# EAGLE schematic baseboard (EAGLE 7.7.0)

## Sheet 1 of 2: POW-System Supply Chain
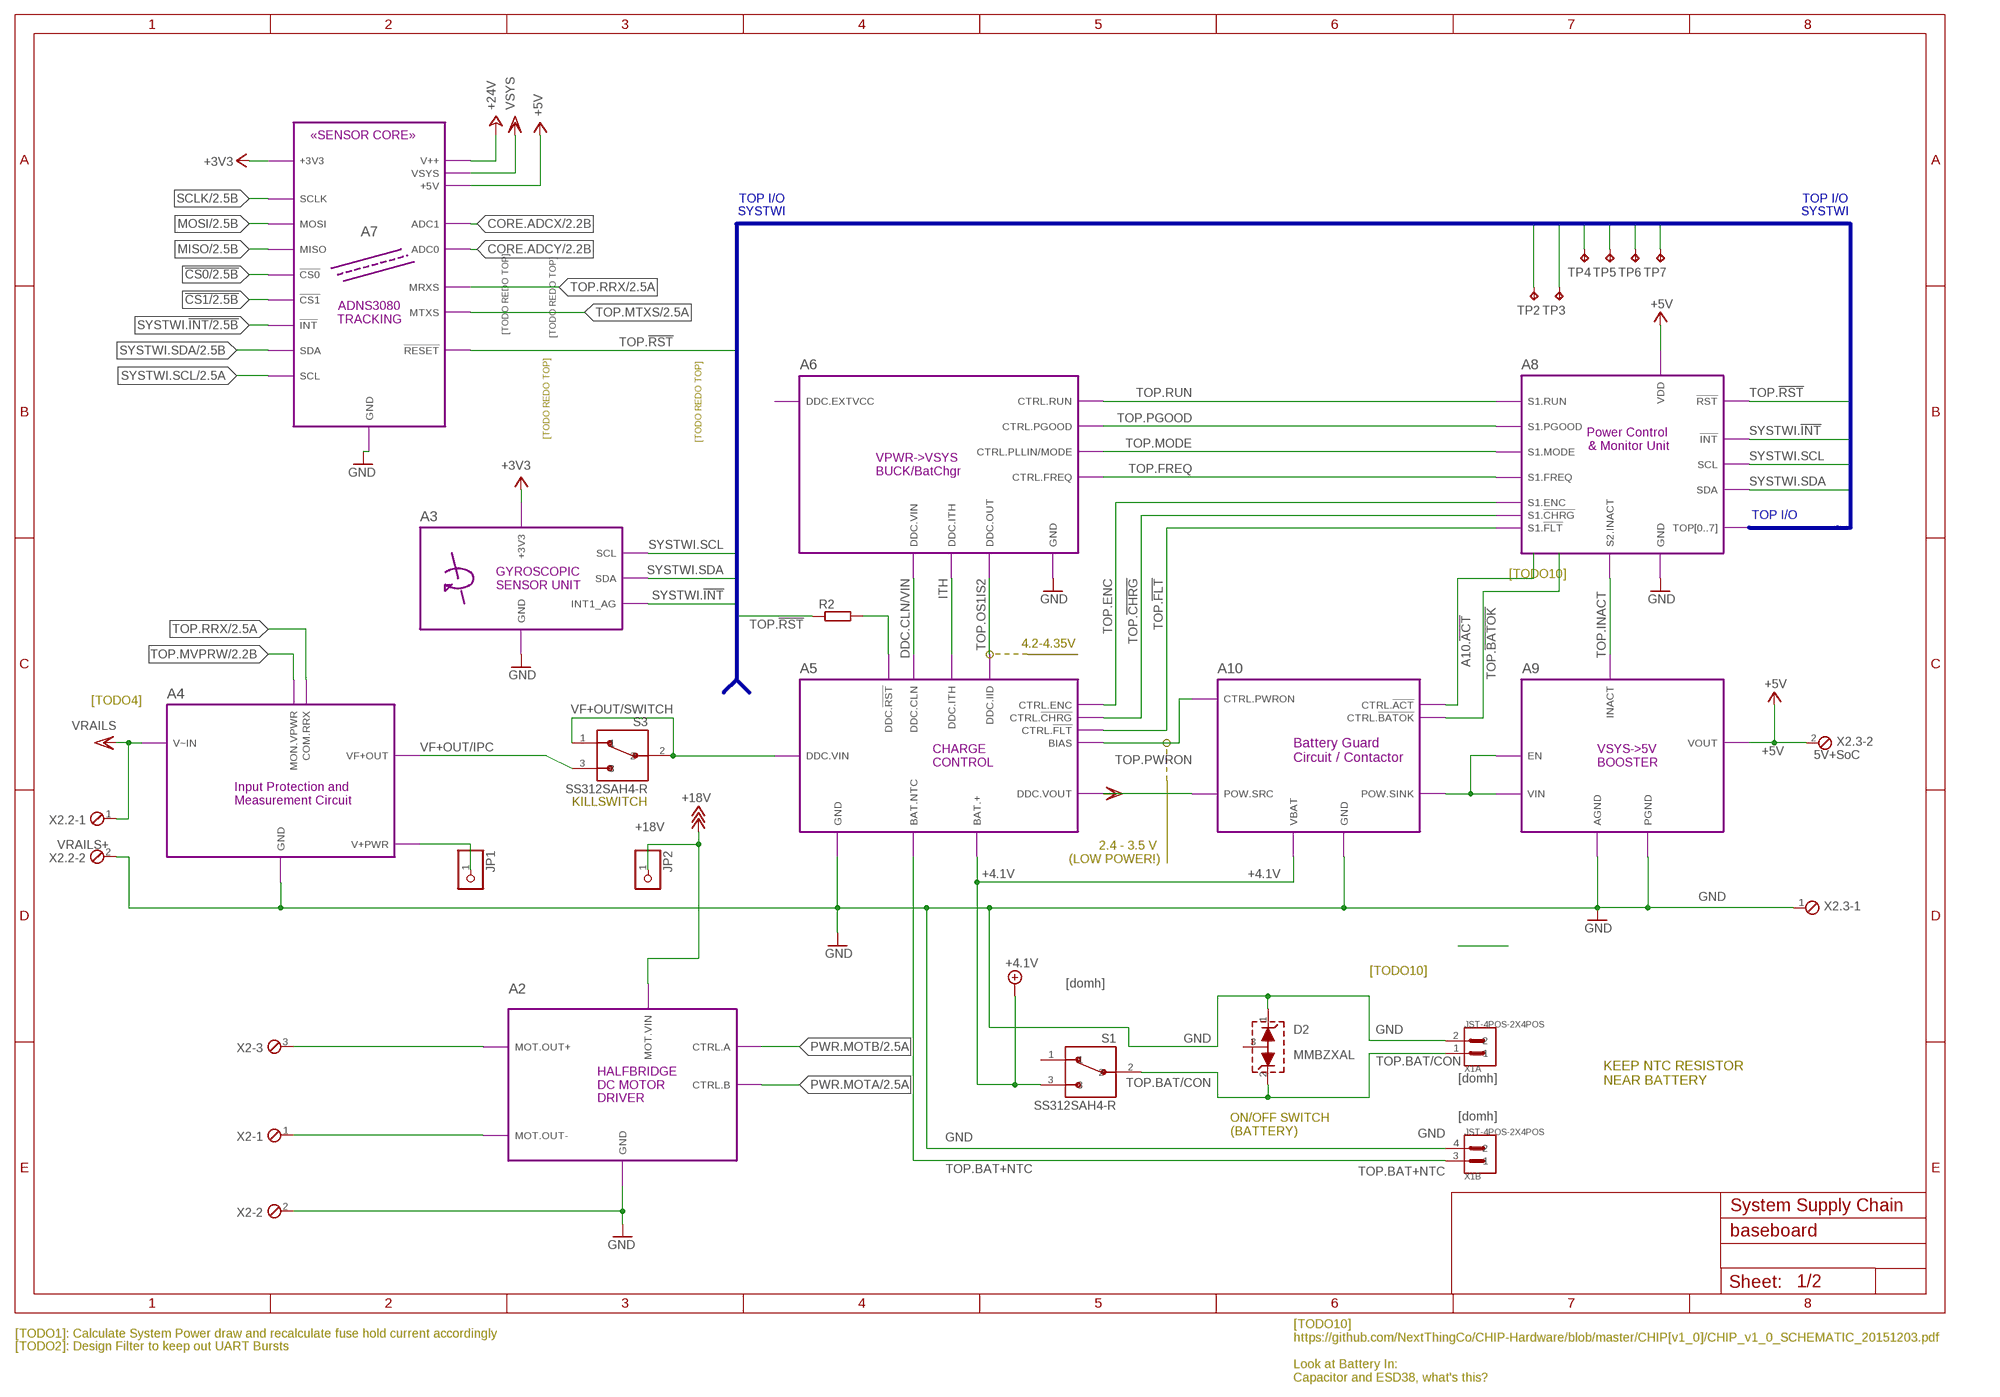
[diagram p0: schematic, sheet 1]

### Parts
D2  MMBZXAL  [TO236]
JP1  PINHD-1X1  [1X01]
JP2  PINHD-1X1  [1X01]
R2  R-EU_R0201  [R0201]
S1  SS312SAH4-R  [SW_SS312SAH4-R]
S3  SS312SAH4-R  [SW_SS312SAH4-R]
TP2  TPTP07R  [TP07R]
TP3  TPTP07R  [TP07R]
TP4  TPTP07R  [TP07R]
TP5  TPTP07R  [TP07R]
TP6  TPTP07R  [TP07R]
TP7  TPTP07R  [TP07R]
X1  JST-4POS-2X4POS  [JST-PHR-4]
X2  MPT3  [3POL254]
X2.2  VRAILS+  MPT2  [2POL254]
X2.3  5V+SoC  MPT2  [2POL254]

### Module instances
A5 = POW-4000
A6 = POW-3891
A2 = POW-8871
A9 = POW-DDC3350
A8 = POW-CTRLMON
A7 = X1-TRACKBOARD3080
A4 = POW-IPMC
A3 = SEN-GYRO1
A10 = POW-1540

### Nets
!CS0: port A7.!CS0 ; also sheet 2
!CS1: port A7.!CS1 ; also sheet 2
!RST: R2.2 ; port A5.DDC.!RST
+3V3: port A7.+3V3 A3.+3V3 ; also sheet 2
+4.1V: S1.3 ; port A5.BAT.+ A10.VBAT ; also sheet 2
+5V: X2.3.2 ; port A9.VOUT A7.+5V A8.VDD ; also sheet 2
+18V: JP2.1 ; port A2.MOT.VIN ; also sheet 2
+24V: JP1.1 ; port A4.V+PWR A7.V++ ; also sheet 2
A10.!ACT: port A10.CTRL.!ACT
CORE.ADCX: port A7.ADC1 ; also sheet 2
CORE.ADCY: port A7.ADC0 ; also sheet 2
DDC.CLN/VIN: port A6.DDC.VIN A5.DDC.CLN
GND: D2.1(A) X1.2 X1.4 X2.2 X2.2.2 X2.3.1 ; port A6.GND A5.GND A9.AGND A9.PGND A4.GND A10.GND A2.GND A7.GND A3.GND A8.GND ; also sheet 2
ITH: port A6.DDC.ITH A5.DDC.ITH
MISO: port A7.MISO ; also sheet 2
MOSI: port A7.MOSI ; also sheet 2
PWR.MOTA: port A2.CTRL.B ; also sheet 2
PWR.MOTB: port A2.CTRL.A ; also sheet 2
SCLK: port A7.SCLK ; also sheet 2
SYSTWI.!INT: port A3.INT1_AG A8.!INT A7.!INT ; also sheet 2
SYSTWI.SCL: port A3.SCL A8.SCL A7.SCL ; also sheet 2
SYSTWI.SDA: port A3.SDA A8.SDA A7.SDA ; also sheet 2
TOP1: TP2.TP
TOP2: TP3.TP
TOP3: TP4.TP
TOP4: TP5.TP
TOP5: TP6.TP
TOP6: TP7.TP
TOP.!BATOK: port A10.CTRL.!BATOK
TOP.!CHRG: port A5.CTRL.!CHRG A8.S1.!CHRG
TOP.!FLT: port A5.CTRL.!FLT A8.S1.!FLT
TOP.!RST: R2.1 ; port A8.!RST A7.!RESET ; also sheet 2
TOP.BAT+NTC: X1.3 ; port A5.BAT.NTC
TOP.BAT/CON: D2.2(B) S1.2 X1.1
TOP.ENC: port A5.CTRL.ENC A8.S1.ENC
TOP.FREQ: port A8.S1.FREQ A6.CTRL.FREQ
TOP.INACT: port A8.S2.INACT A9.INACT
TOP.MODE: port A8.S1.MODE A6.CTRL.PLLIN/MODE
TOP.MOT-: X2.1 ; port A2.MOT.OUT-
TOP.MTXS: port A7.MTXS ; also sheet 2
TOP.MVPRW: port A4.MON.VPWR ; also sheet 2
TOP.OS1IS2: port A6.DDC.OUT A5.DDC.IID
TOP.PGOOD: port A8.S1.PGOOD A6.CTRL.PGOOD
TOP.PWRON: port A5.BIAS A10.CTRL.PWRON
TOP.RRX: port A4.COM.RRX A7.MRXS ; also sheet 2
TOP.RUN: port A6.CTRL.RUN A8.S1.RUN
TOP.VSYS/GUARD: port A9.VIN A10.POW.SINK A9.EN
VCC/2: X2.2.1 ; port A4.V~IN ; supply symbol labelled VRAILS
VDD: port A5.DDC.VOUT A10.POW.SRC A7.VSYS ; supply symbol labelled NOT VSYS ANYMORE, VSYS ; also sheet 2
VF+OUT/IPC: S3.3 ; port A4.VF+OUT
VF+OUT/SWITCH: S3.1 S3.2 ; port A5.DDC.VIN
✳TOP.MOT+: X2.3 ; port A2.MOT.OUT+
Unconnected: D2.3(COM) S1.1

### Buses
TOP[0..7],SYSTWI.SCL,SYSTWI.SDA,SYSTWI.!INT,TOP.!RST
TOP[0..7]

### Notes on the sheet
- «SENSOR CORE»
- TOP I/O | TOP I/O
- SYSTWI | SYSTWI
- ADNS3080
  TRACKING
- [TODO REDO TOP]
- [TODO REDO TOP]
- ⨯
- [TODO REDO TOP]
- Power Control 
  & Monitor Unit
- [TODO REDO TOP]
- ↯
- VPWR->VSYS
  BUCK/BatChgr
- ⎚
- TOP I/O
- GYROSCOPIC
  SENSOR UNIT
- [TODO10]
- 4.2-4.35V
- [TODO4]
- ⎚ | ⎚ | ↯
- CHARGE
  CONTROL
- VSYS->5V
  BOOSTER
- Battery Guard 
  Circuit / Contactor
- ↯
- ↯
- Input Protection and 
  Measurement Circuit
- KILLSWITCH
- 2.4 - 3.5 V 
  (LOW POWER!)
- [TODO10]
- [domh]
- [domh]
- ↯
- HALFBRIDGE
  DC MOTOR
  DRIVER
- KEEP NTC RESISTOR
  NEAR BATTERY
- [domh]
- ON/OFF SWITCH
  (BATTERY)
- System Supply Chain
- [TODO1]: Calculate System Power draw and recalculate fuse hold current accordingly
- [TODO2]: Design Filter to keep out UART Bursts
- [TODO10]
  https://github.com/NextThingCo/CHIP-Hardware/blob/master/CHIP[v1_0]/CHIP_v1_0_SCHEMATIC_20151203.pdf
  
  Look at Battery In:
  Capacitor and ESD38, what's this?

## Sheet 2 of 2: X - Connectors Inputs, Outputs and Power
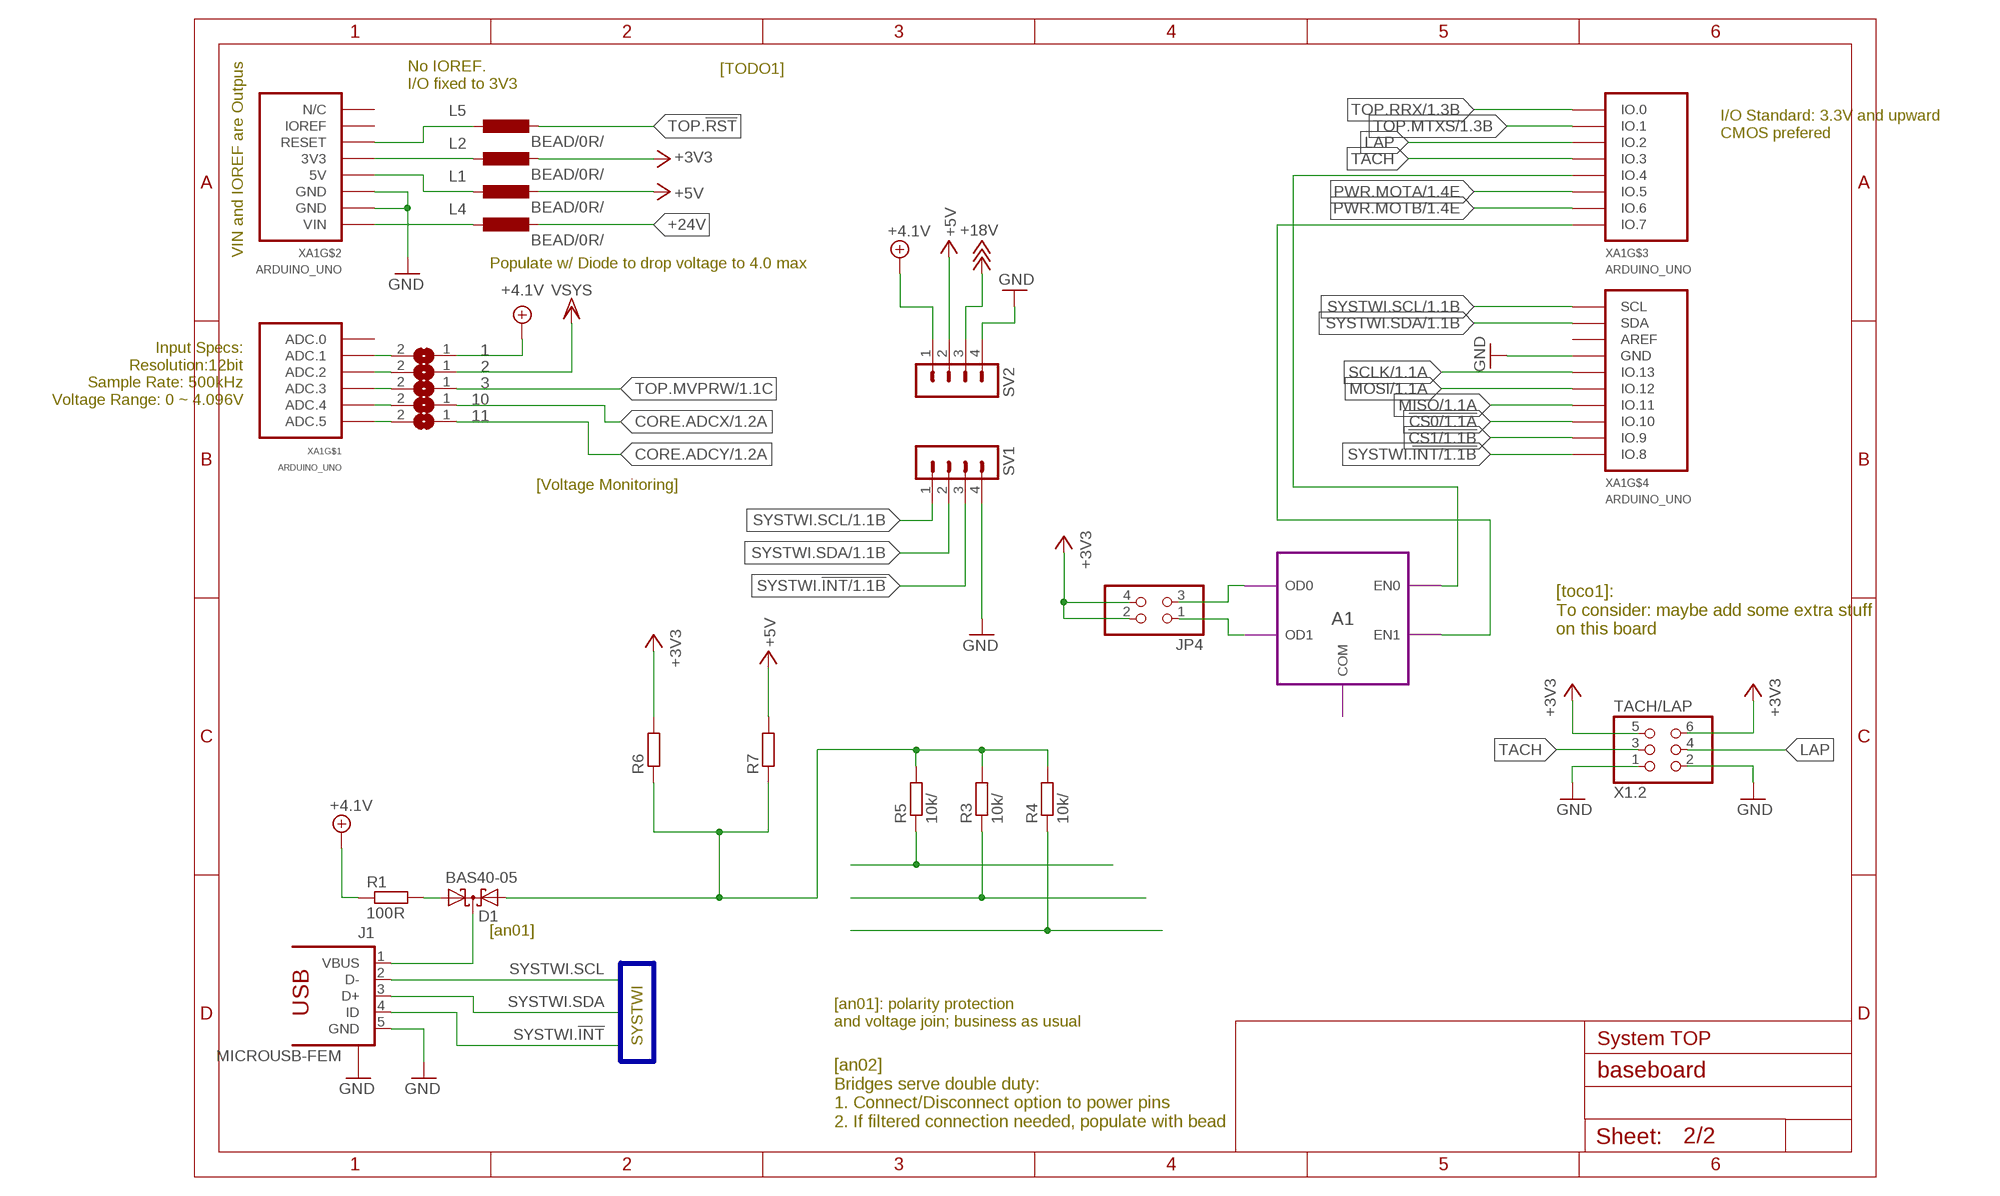
[diagram p1: schematic, sheet 2]

### Parts
D1  BAS40-05  [SOT23]
J1  MICROUSB-FEM  [10118192-0001LF]
JP4  PINHD-2X2  [2X02]
L1  BEAD/0R/⎵  L-EUL2012C  [L2012C]
L2  BEAD/0R/⎵  L-EUL2012C  [L2012C]
L4  BEAD/0R/⎵  L-EUL2012C  [L2012C]
L5  BEAD/0R/⎵  L-EUL2012C  [L2012C]
R1  100R  R-EU_R0402  [R0402]
R3  10k/⎒  R-EU_R0402  [R0402]
R4  10k/⎒  R-EU_R0402  [R0402]
R5  10k/⎒  R-EU_R0402  [R0402]
R6  R-EU_R0201  [R0201]
R7  R-EU_R0201  [R0201]
SV1  MA04-1  [MA04-1]
SV2  MA04-1  [MA04-1]
X1.2  TACH/LAP  PINHD-2X3  [2X03]
XA1  ARDUINO_UNO  [AU_PINS]
☈1  SJ  [SJ]
☈2  SJ  [SJ]
☈3  SJ  [SJ]
☈10  SJ  [SJ]
☈11  SJ  [SJ]

### Module instances
A1 = POW-DRV01

### Nets
!CS0: XA1.IO.10 ; also sheet 1
!CS1: XA1.IO.9 ; also sheet 1
+3V3: JP4.2 JP4.4 L2.1 R6.2 X1.2.5 X1.2.6 ; also sheet 1
+4.1V: R1.1 SV2.1 ☈1.1 ; also sheet 1
+5V: L1.1 R7.2 SV2.2 ; also sheet 1
+18V: SV2.3 ; also sheet 1
+24V: L4.1 ; also sheet 1
CORE.ADCX: ☈10.1 ; also sheet 1
CORE.ADCY: ☈11.1 ; also sheet 1
GND: J1.5(GND) J1.M1(S) J1.M2(S) J1.S1(S) J1.S2(S) J1.S3(S) J1.S4(S) SV1.4 SV2.4 X1.2.1 X1.2.2 XA1.GND2(GND) XA1.GND3(GND) XA1.GND.1(GND) ; also sheet 1
LAP: X1.2.4 XA1.IO.2
MISO: XA1.IO.11 ; also sheet 1
MOSI: XA1.IO.12 ; also sheet 1
N$1: D1.3(C) J1.1(VBUS)
N$2: JP4.1 ; port A1.OD1
N$3: JP4.3 ; port A1.OD0
N$4: D1.1(A1) R1.2
N$5: XA1.IO.7 ; port A1.EN1
N$6: XA1.IO.4 ; port A1.EN0
N$7: XA1.ADC.3 ☈3.2
N$8: XA1.ADC.2 ☈2.2
N$9: XA1.ADC.1 ☈1.2
N$11: D1.2(A2) R3.2 R4.2 R5.2 R6.1 R7.1
PWR.MOTA: XA1.IO.5 ; also sheet 1
PWR.MOTB: XA1.IO.6 ; also sheet 1
SCLK: XA1.IO.13 ; also sheet 1
SYSTWI.!INT: J1.4(ID) R5.1 SV1.3 XA1.IO.8 ; also sheet 1
SYSTWI.SCL: J1.2(D-) R3.1 SV1.1 XA1.SCL ; also sheet 1
SYSTWI.SDA: J1.3(D+) R4.1 SV1.2 XA1.SDA ; also sheet 1
TACH: X1.2.3 XA1.IO.3
TOP.!RST: L5.1 ; also sheet 1
TOP.MTXS: XA1.IO.1 ; also sheet 1
TOP.MVPRW: ☈3.1 ; also sheet 1
TOP.RRX: XA1.IO.0 ; also sheet 1
UNO.3V3: L2.2 XA1.3.3V(3V3)
UNO.5V: L1.2 XA1.5V
UNO.ADC4: XA1.ADC.4 ☈10.2
UNO.ADC5: XA1.ADC.5 ☈11.2
UNO.RESET: L5.2 XA1.RESET
UNO.VIN: L4.2 XA1.VIN
VDD: ☈2.1 ; supply symbol labelled VSYS ; also sheet 1
Unconnected: XA1.ADC.0 XA1.AREF XA1.I/OREF(IOREF) XA1.N/C

### Buses
TOP[0..7],SYSTWI.SCL,SYSTWI.SDA,SYSTWI.!INT,TOP.!RST

### Notes on the sheet
- No IOREF.
  I/O fixed to 3V3
- [TODO1]
- ⨯
- I/O Standard: 3.3V and upward
  CMOS prefered
- ⨯
- VIN and IOREF are Outpus | Populate w/ Diode to drop voltage to 4.0 max
- ⨯
- Input Specs:
  Resolution:12bit
  Sample Rate: 500kHz
  Voltage Range: 0 ~ 4.096V
- [Voltage Monitoring]
- [toco1]:
  To consider: maybe add some extra stuff
  on this board
- [an01]
- [an01]: polarity protection
  and voltage join; business as usual
- SYSTWI | System TOP
- [an02]
  Bridges serve double duty:
  1. Connect/Disconnect option to power pins
  2. If filtered connection needed, populate with bead

## Library data of the parts
D1 = diode:BAS40-05: Silicon Schottky Diodes General-purpose diode for high-speed switching
D2 = kitt.ic:MMBZXAL; CC: XYX17
J1 = kitt.con:MICROUSB-FEM: USB - microUSB Type B, FCI; AVAILABILITY: Good; DESCRIPTION: Conn Micro USB Type B RCP 5 POS 0.65mm Solder RA SMD 5 Terminal 1 Port T/R; MF: FCI; MP: 10118192-0001LF; PACKAGE: None; PRICE: 0.24 USD
JP1 JP2 = pinhead:PINHD-1X1: PIN HEADER
JP4 = pinhead:PINHD-2X2: PIN HEADER
L1 L2 L4 L5 = rcl:L-EU: INDUCTOR, European symbol
R1-R7 = rcl:R-EU_: RESISTOR, European symbol
S1 S3 = kitt.psvs:SS312SAH4-R: Switch Slide ON None ON SPDT Side Slide 0.1A 28VAC 28VDC 0.4VA 10000Cycles Gull Wing SMD T/R; AVAILABILITY: Good; DESCRIPTION: Switch Slide ON None ON SPDT Side Slide 0.1A 28VAC 28VDC 0.4VA 10000Cycles Gull Wing SMD T/R; MF: NKK Switches; MP: SS312SAH4-R; PACKAGE: None; PRICE: 2.48 USD
SV1 SV2 = con-lstb:MA04-1: PIN HEADER; OC_FARNELL: unknown; OC_NEWARK: unknown
TP2-TP7 = testpad:TP: Test pad
X1 = kitt.con:JST-4POS-2X; CC: XYX17
X1.2 = pinhead:PINHD-2X3: PIN HEADER
X2 = con-phoenix-254:MPT3: PHOENIX CONNECTOR; OC_FARNELL: unknown; OC_NEWARK: unknown
X2.2 X2.3 = con-phoenix-254:MPT2: PHOENIX CONNECTOR; OC_FARNELL: unknown; OC_NEWARK: unknown
XA1 = kitt.con:ARDUINO_UNO
☈1-☈3 ☈10 ☈11 = jumper:SJ: SMD solder JUMPER

## Module POW-4000
Ports: DDC.!RST(out) BAT.+(pwr) BAT.NTC(io) GND(pwr) DDC.CLN(io) DDC.ITH(io) DDC.VIN(pwr) DDC.VOUT(pwr) DDC.IID(io) CTRL.ENC(in) CTRL.!CHRG(out) CTRL.!FLT(out) BIAS(io)
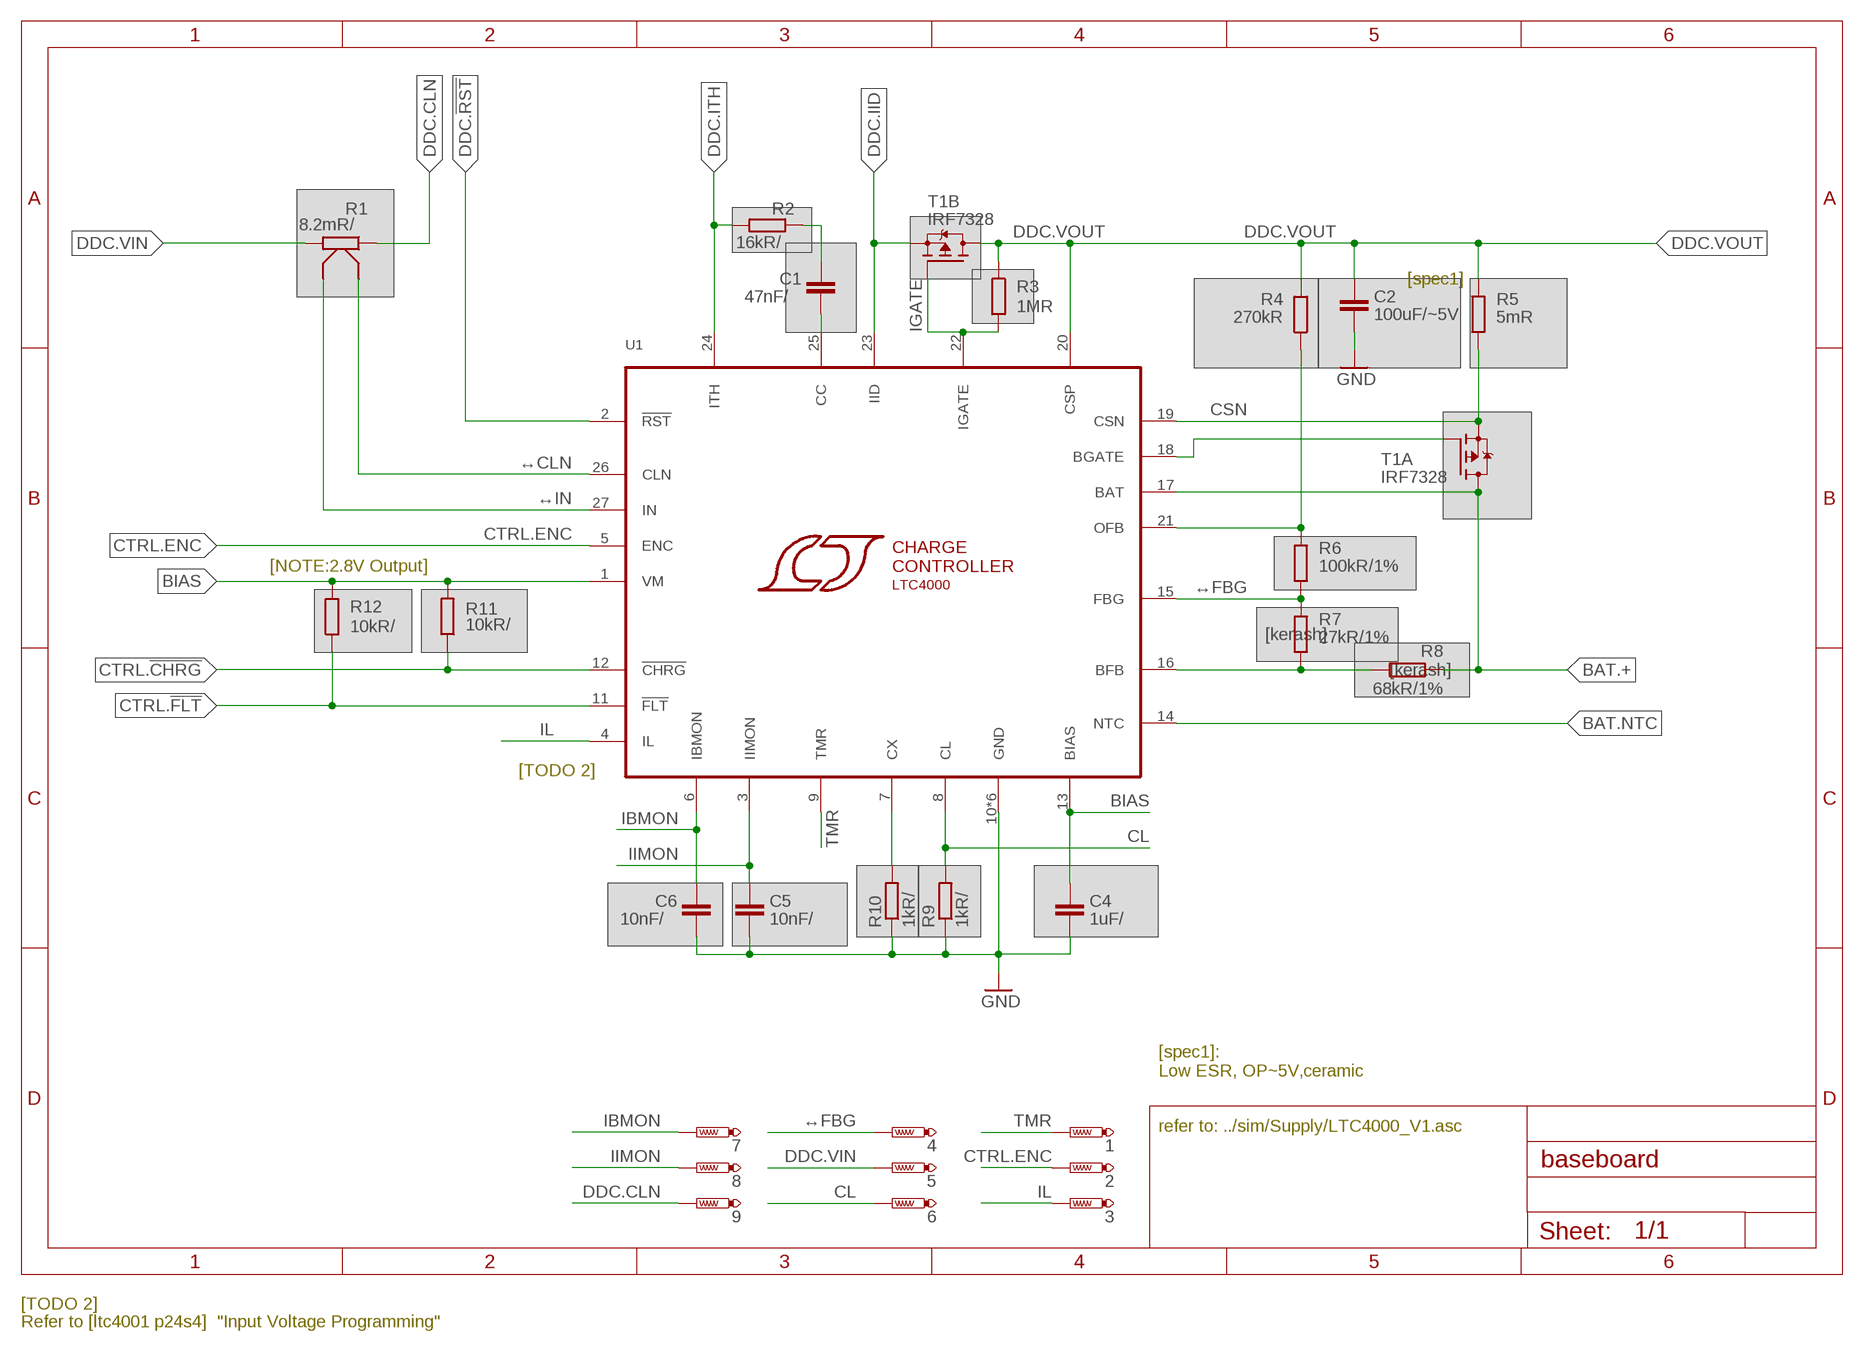
[diagram p2: schematic, module POW-4000, sheet 1]

### Parts
C1  47nF/⇤  C-EUC0603K  [C0603K]
C2  100uF/~5V  C-EUC1206K  [C1206K]
C4  1uF/⇤  C-EUC0402K  [C0402K]
C5  10nF/⇤  C-EUC0402K  [C0402K]
C6  10nF/⇤  C-EUC0402K  [C0402K]
R1  8.2mR/⚻  RKELV1206  [R1206-KELV]
R2  16kR/⇤  R-EU_R0402  [R0402]
R3  1MR  R-EU_R0805  [R0805]
R4  270kR  R-EU_R0402  [R0402]
R5  5mR  R-EU_R0805  [R0805]
R6  100kR/1%  R-EU_R0402  [R0402]
R7  27kR/1%  R-EU_R0402  [R0402]
R8  68kR/1%  R-EU_R0402  [R0402]
R9  1kR/⇤  R-EU_R0402  [R0402]
R10  1kR/⇤  R-EU_R0402  [R0402]
R11  10kR/⎒  R-EU_R0402  [R0402]
R12  10kR/⎒  R-EU_R0402  [R0402]
T1  IRF7328  [SOIC8]
U1  LTC4000LTC4000EUFD#XXX  [QFN-28_UFD-L]
☇1  PTR1TP07SQ  [TP07SQ]
☇2  PTR1TP07SQ  [TP07SQ]
☇3  PTR1TP07SQ  [TP07SQ]
☇4  PTR1TP07SQ  [TP07SQ]
☇5  PTR1TP07SQ  [TP07SQ]
☇6  PTR1TP07SQ  [TP07SQ]
☇7  PTR1TP07SQ  [TP07SQ]
☇8  PTR1TP07SQ  [TP07SQ]
☇9  PTR1TP07SQ  [TP07SQ]

### Nets
BAT.+: R8.2 T1.7(A:D) T1.8(A:D) U1.17(BAT)
BAT.NTC: U1.14(NTC)
BGATE: T1.2(A:G) U1.18(BGATE)
BIAS: C4.1 R11.2 R12.2 U1.1(VM) U1.13(BIAS)
CC: C1.2 U1.25(CC)
CL: R9.2 U1.8(CL) ☇6.TP
CSN: R5.1 T1.1(A:S) U1.19(CSN)
CTRL.!CHRG: R11.1 U1.12(!CHRG)
CTRL.!FLT: R12.1 U1.11(!FLT)
CTRL.ENC: U1.5(ENC) ☇2.TP
CX: R10.2 U1.7(CX)
DDC.!RST: U1.2(!RST)
DDC.CLN: R1.+ ☇9.TP
DDC.IID: T1.3(B:S) U1.23(IID)
DDC.ITH: R2.2 U1.24(ITH)
DDC.VIN: R1.- ☇5.TP
DDC.VOUT: C2.1 R3.1 R4.2 R5.2 T1.5(B:D) T1.6(B:D) U1.20(CSP)
GND: C2.2 C4.2 C5.2 C6.2 R9.1 R10.1 U1.10(GND) U1.28(GND) U1.EP-NE(GND) U1.EP-NW(GND) U1.EP-SE(GND) U1.EP-SW(GND)
IBMON: C6.1 U1.6(IBMON) ☇7.TP
IGATE: R3.2 T1.4(B:G) U1.22(IGATE)
IIMON: C5.1 U1.3(IIMON) ☇8.TP
IL: U1.4(IL) ☇3.TP
N$4: C1.1 R2.1
N$8: R7.1 R8.1 U1.16(BFB)
OFB: R4.1 R6.2 U1.21(OFB)
TMR: U1.9(TMR) ☇1.TP
↔CLN: R1.K+ U1.26(CLN)
↔FBG: R6.1 R7.2 U1.15(FBG) ☇4.TP
↔IN: R1.K- U1.27(IN)

### Notes on the sheet
- [spec1]
- [NOTE:2.8V Output]
- [kerash]
- [kerash]
- [TODO 2]
- [spec1]: 
  Low ESR, OP~5V,ceramic
- refer to: ../sim/Supply/LTC4000_V1.asc
- [TODO 2]
- Refer to [ltc4001 p24s4]  "Input Voltage Programming"

### Library data of the parts
C1 C2 C4-C6 = rcl:C-EU: CAPACITOR, European symbol
R1 = kitt.psvs:RKELV
R2-R12 = rcl:R-EU_: RESISTOR, European symbol
T1 = kitt.ic:IRF7328; CC: XYX17
U1 = kitt.ic:LTC4000; CC: XYX17
☇1-☇9 = testpad:PTR1: TEST PIN

## Module POW-3891
Ports: DDC.VIN(io) DDC.ITH(io) DDC.OUT(io) CTRL.RUN(in) CTRL.PGOOD(out) CTRL.PLLIN/MODE(in) CTRL.FREQ(in) GND(pwr) DDC.EXTVCC(pwr)
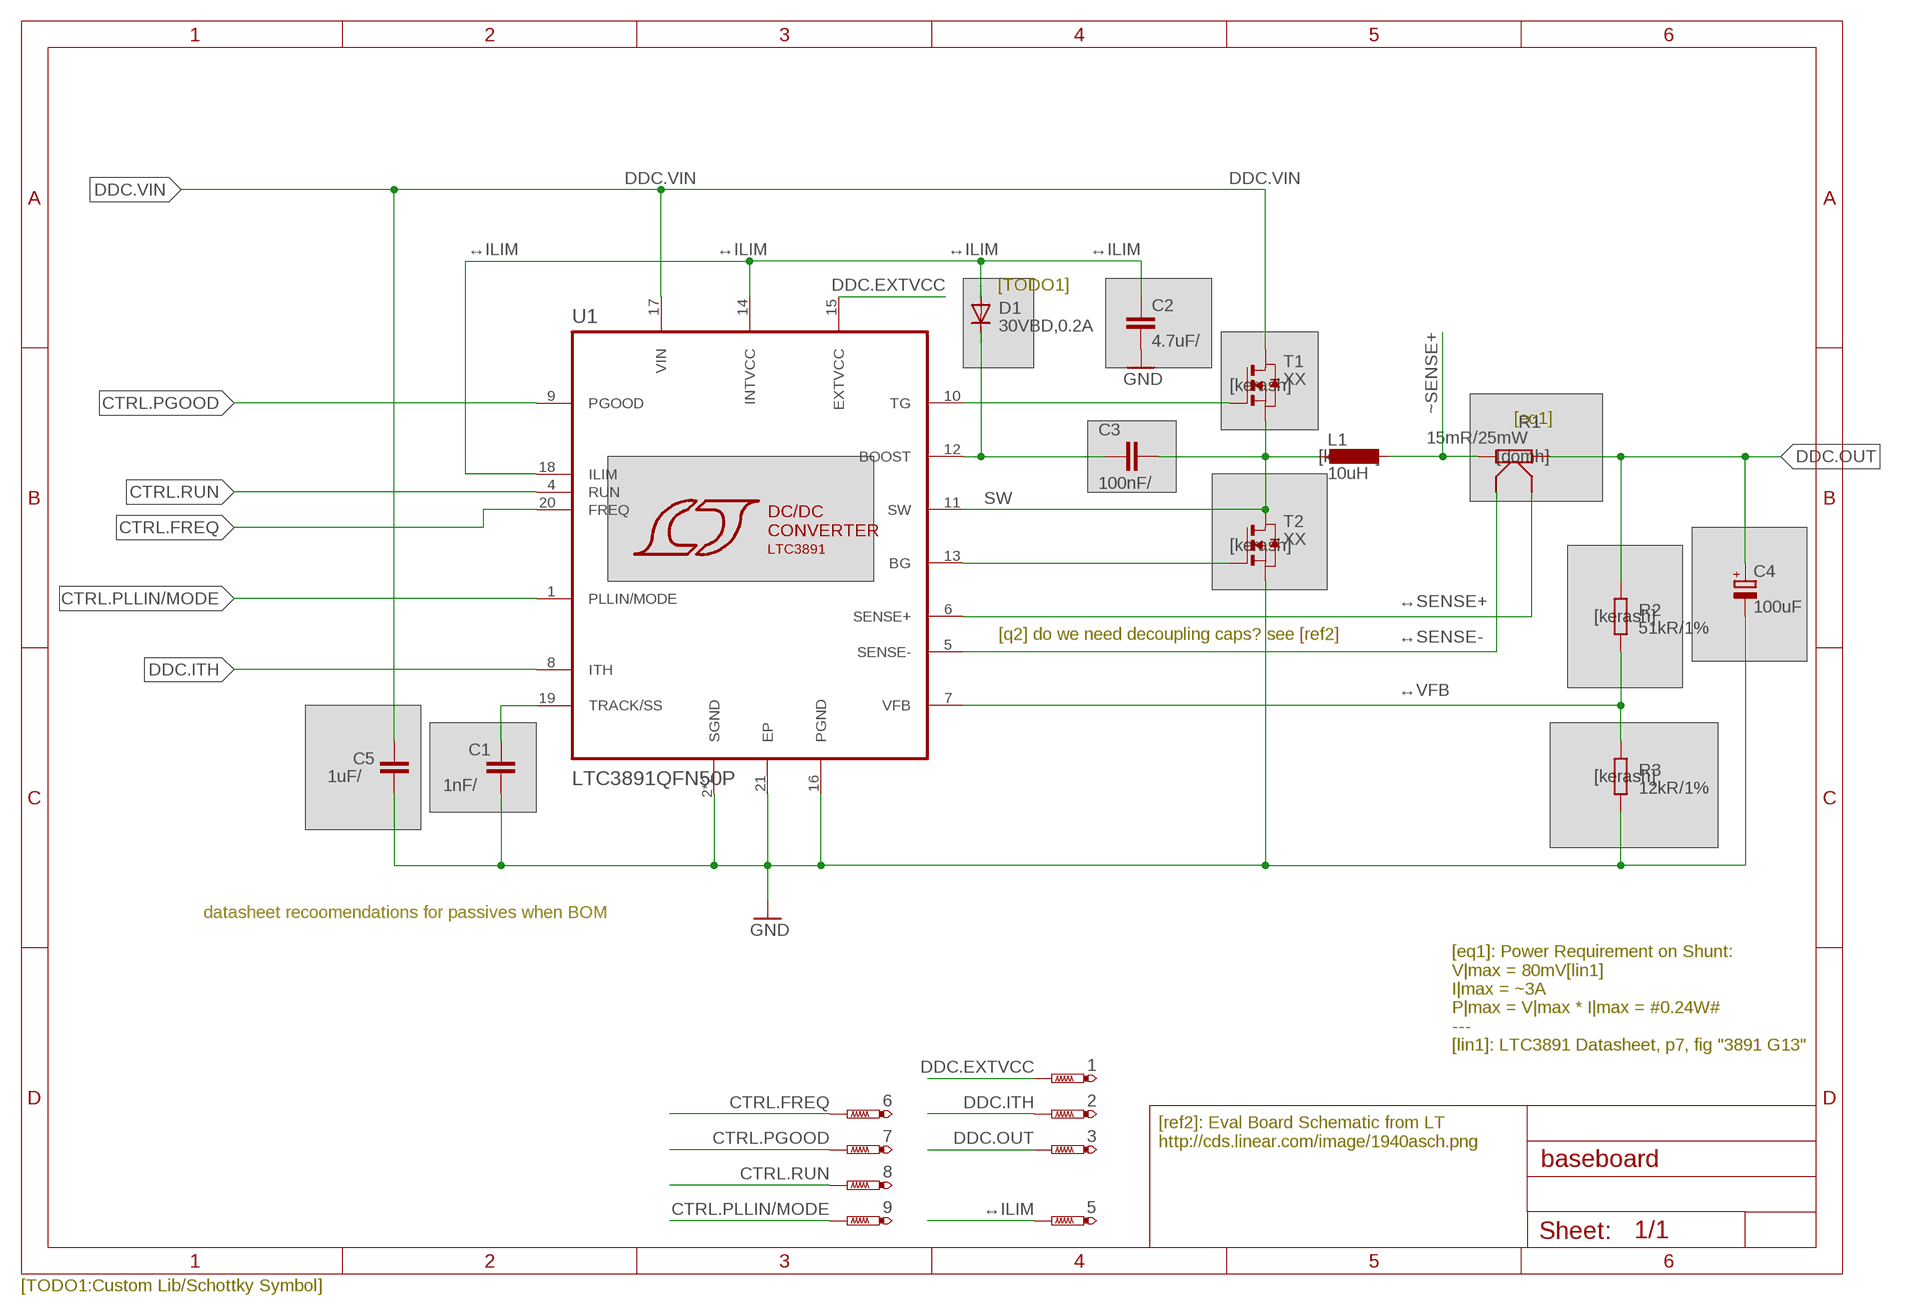
[diagram p3: schematic, module POW-3891, sheet 1]

### Parts
C1  1nF/⇤  C-EUC0402  [C0402]
C2  4.7uF/⇤  C-EUC0805  [C0805]
C3  100nF/⇤  C-EUC0402  [C0402]
C4  100uF  CPOL-EUC/6032-28R  [C/6032-28R]
C5  1uF/⇤  C-EUC0402K  [C0402K]
D1  30VBD,0.2A  DIODE-SOD323-W  [SOD323-W]
L1  10uH  NRS8030XX  [TAIYO-YUDEN.NRS8030T4R7MJGJ]
R1  15mR/25mW⚻  RKELV1206  [R1206-KELV]
R2  51kR/1%  R-EU_R0603  [R0603]
R3  12kR/1%  R-EU_R0603  [R0603]
T1  XX  NMOSMSOP8  [MSOP8]
T2  XX  NMOSMSOP8  [MSOP8]
U1  LTC3891QFN50P  [QFN50P]
☇1  PTR1TP07SQ  [TP07SQ]
☇2  PTR1TP07SQ  [TP07SQ]
☇3  PTR1TP07SQ  [TP07SQ]
☇5  PTR1TP07SQ  [TP07SQ]
☇6  PTR1TP07R  [TP07R]
☇7  PTR1TP07R  [TP07R]
☇8  PTR1TP07R  [TP07R]
☇9  PTR1TP07R  [TP07R]

### Nets
BG: T2.4(G) U1.13(BG)
CTRL.FREQ: U1.20(FREQ) ☇6.TP
CTRL.PGOOD: U1.9(PGOOD) ☇7.TP
CTRL.PLLIN/MODE: U1.1(PLLIN/MODE) ☇9.TP
CTRL.RUN: U1.4(RUN) ☇8.TP
DDC.EXTVCC: U1.15(EXTVCC) ☇1.TP
DDC.ITH: U1.8(ITH) ☇2.TP
DDC.OUT: C4.+ R1.+ R2.1 ☇3.TP
DDC.VIN: C5.1 T1.5(D) T1.6(D) T1.7(D) T1.8(D) U1.17(VIN)
GND: C1.2 C2.2 C4.- C5.2 R3.2 T2.1(S) T2.2(S) T2.3(S) U1.2(SGND) U1.3(SGND) U1.16(PGND) U1.21(EP)
SW✳: C3.2 L1.2 T1.1(S) T1.2(S) T1.3(S) T2.5(D) T2.6(D) T2.7(D) T2.8(D) U1.11(SW)
TG: T1.4(G) U1.10(TG)
TRACK/SS: C1.1 U1.19(TRACK/SS)
~SENSE+: L1.1 R1.-
↔BOOST: C3.1 D1.C U1.12(BOOST)
↔ILIM: C2.1 D1.A U1.14(INTVCC) U1.18(ILIM) ☇5.TP
↔SENSE+: R1.K+ U1.6(SENSE+)
↔SENSE-: R1.K- U1.5(SENSE-)
↔VFB: R2.2 R3.1 U1.7(VFB)

### Notes on the sheet
- [TODO1]
- [kerash]
- [eq1]
- [kerash] | [domh]
- [kerash]
- [kerash]
- [q2] do we need decoupling caps? see [ref2]
- [kerash]
- datasheet recoomendations for passives when BOM
- [eq1]: Power Requirement on Shunt:
  V|max = 80mV[lin1]
  I|max = ~3A
  P|max = V|max * I|max = #0.24W#
  ---
  [lin1]: LTC3891 Datasheet, p7, fig "3891 G13"
- [ref2]: Eval Board Schematic from LT
  http://cds.linear.com/image/1940asch.png
- [TODO1:Custom Lib/Schottky Symbol]

### Library data of the parts
C1-C3 C5 = rcl:C-EU: CAPACITOR, European symbol
C4 = rcl:CPOL-EU: POLARIZED CAPACITOR, European symbol
D1 = diode:DIODE-: DIODE
L1 = kitt.psvs:NRS8030XX
R1 = kitt.psvs:RKELV
R2 R3 = rcl:R-EU_: RESISTOR, European symbol
T1 T2 = zetex:NMOSMSOP8: MOS FET; OC_FARNELL: unknown; OC_NEWARK: unknown
U1 = kitt.ic:LTC3891: Step-Down Controller
☇1-☇3 ☇5-☇9 = testpad:PTR1: TEST PIN

## Module POW-8871
Ports: GND(pwr) CTRL.A(in) CTRL.B(in) MOT.OUT+(pwr) MOT.OUT-(pwr) MOT.VIN(pwr)
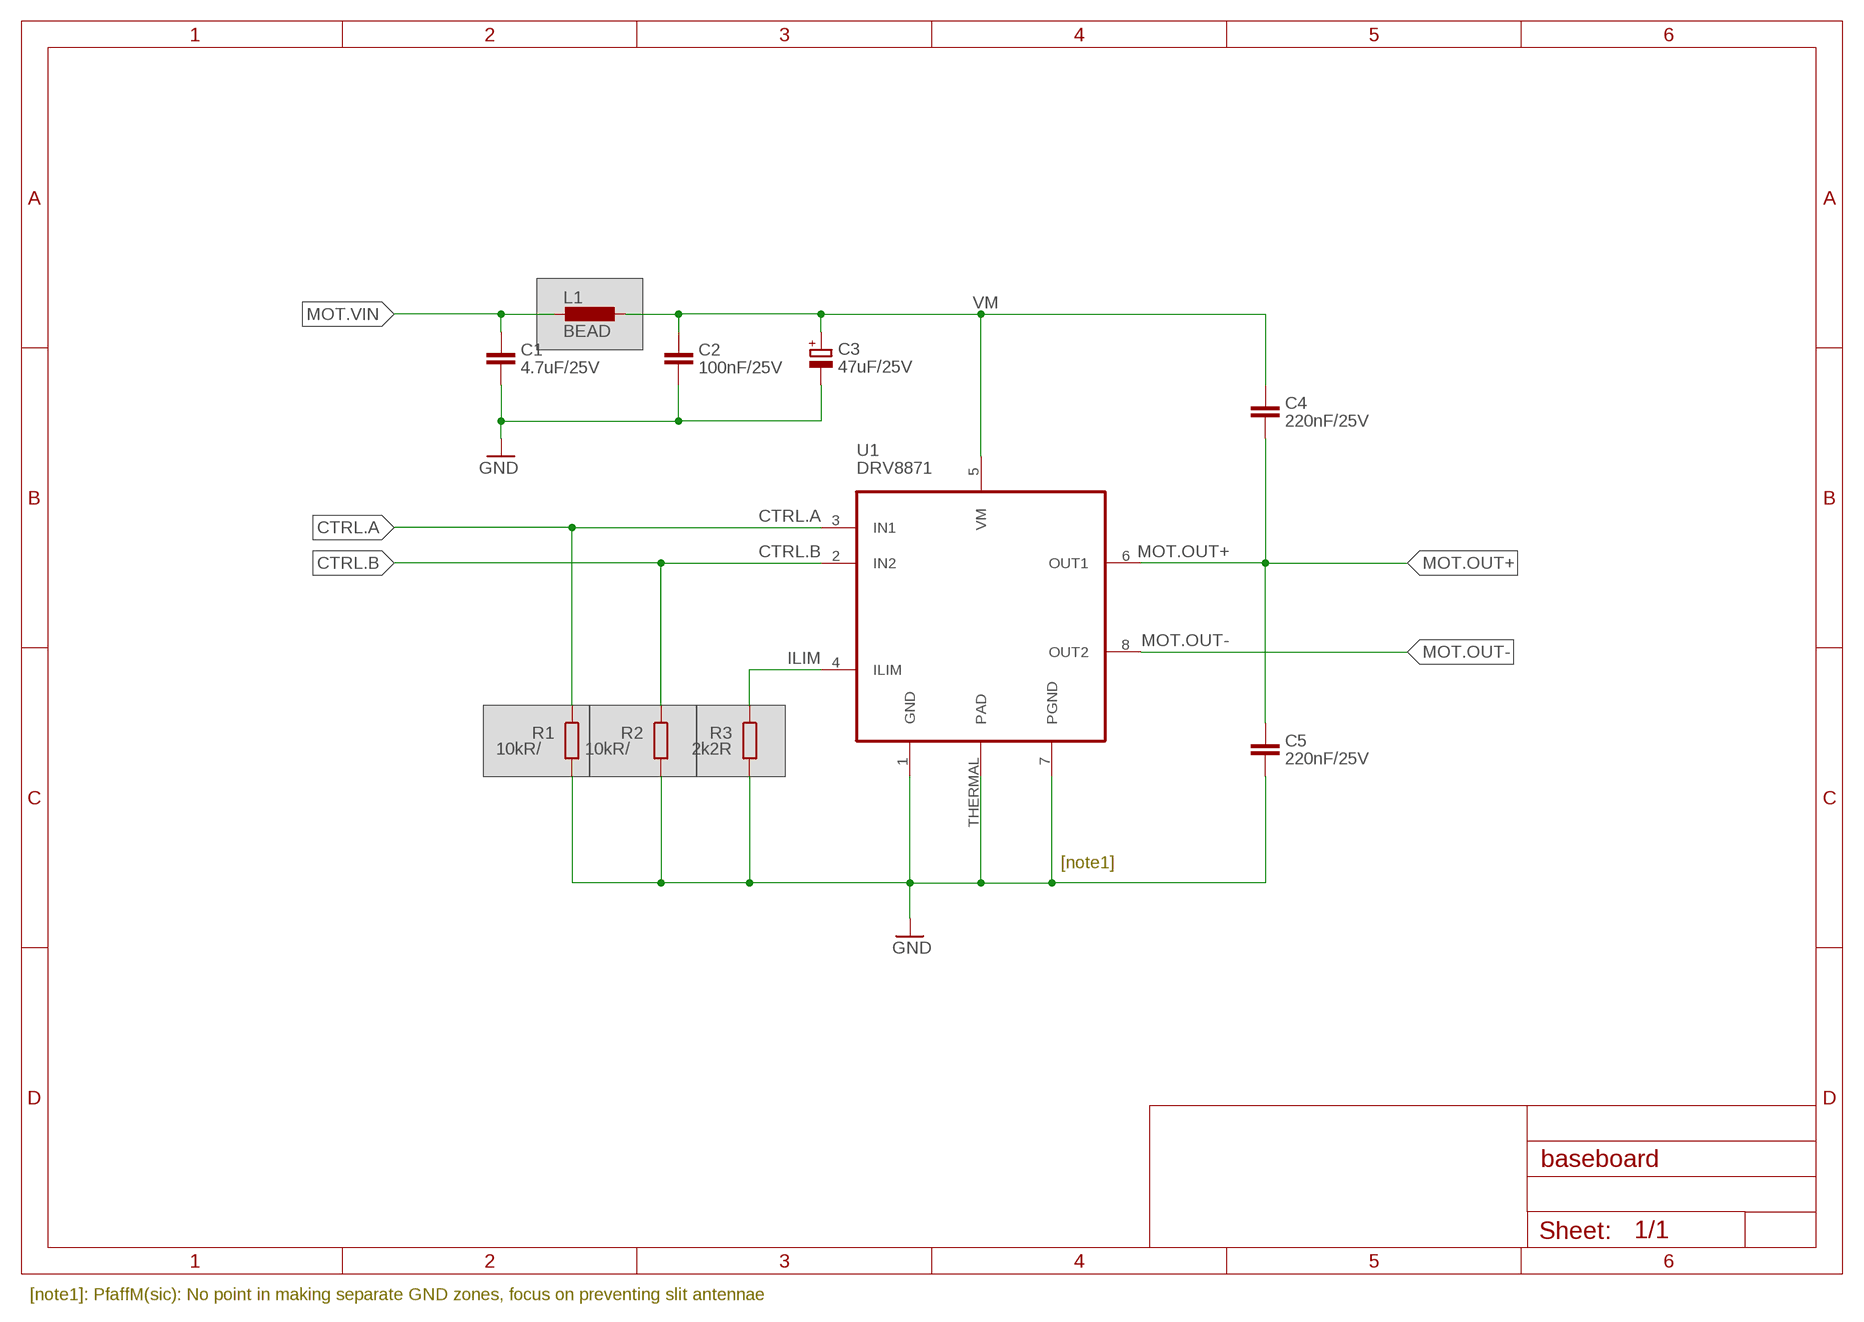
[diagram p4: schematic, module POW-8871, sheet 1]

### Parts
C1  4.7uF/25V  C-EUC0805K  [C0805K]
C2  100nF/25V⇤  C-EUC0603K  [C0603K]
C3  47uF/25V⇤  CPOL-EUCT6032  [CT6032]
C4  220nF/25V⇤  C-EUC0603  [C0603]
C5  220nF/25V⇤  C-EUC0603  [C0603]
L1  BEAD  L-EUL2012C  [L2012C]
R1  10kR/⎑  R-EU_R0402  [R0402]
R2  10kR/⎑  R-EU_R0402  [R0402]
R3  2k2R  R-EU_R0402  [R0402]
U1  DRV8871  DRV8871DRV8871  [HSOP8]

### Nets
CTRL.A: R1.1 U1.3(IN1)
CTRL.B: R2.1 U1.2(IN2)
GND: C1.2 C2.2 C3.- C5.2 R1.2 R2.2 R3.2 U1.1(GND) U1.7(PGND) U1.THERMAL(PAD)
ILIM: R3.1 U1.4(ILIM)
MOT.OUT+: C4.2 C5.1 U1.6(OUT1)
MOT.OUT-: U1.8(OUT2)
MOT.VIN: C1.1 L1.2
VM: C2.1 C3.+ C4.1 L1.1 U1.5(VM)

### Notes on the sheet
- [note1]
- [note1]: PfaffM(sic): No point in making separate GND zones, focus on preventing slit antennae

### Library data of the parts
C1 C2 = rcl:C-EU: CAPACITOR, European symbol
C3 = rcl:CPOL-EU: POLARIZED CAPACITOR, European symbol
C4 C5 = resistor:C-EU: CAPACITOR, European symbol
L1 = rcl:L-EU: INDUCTOR, European symbol
R1-R3 = rcl:R-EU_: RESISTOR, European symbol
U1 = kitt.ic:DRV8871

## Module SEN-GYRO1
Ports: +3V3(pwr) GND(pwr) SCL(io) SDA(io) INT1_AG(out)
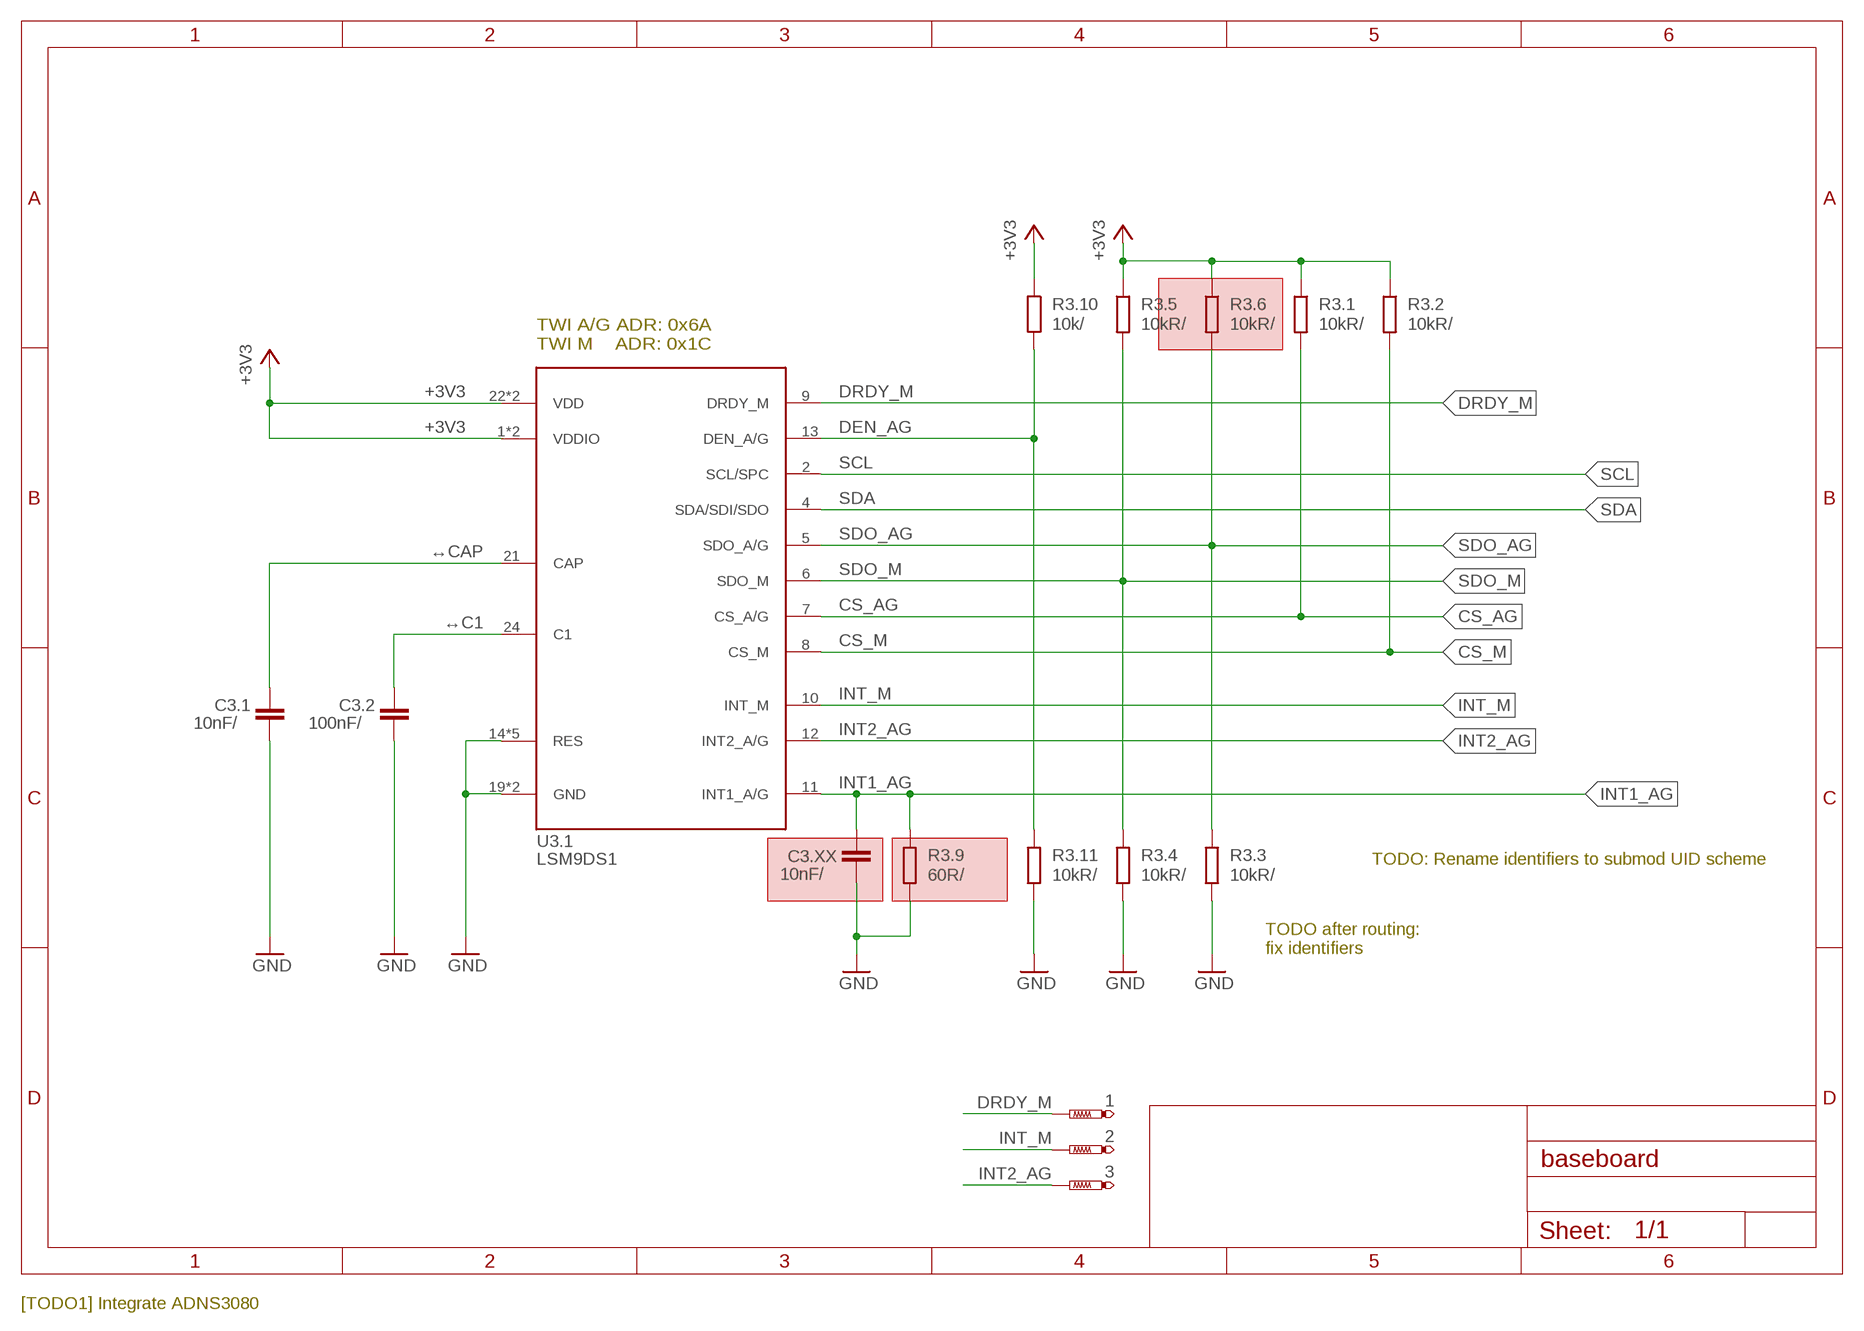
[diagram p5: schematic, module SEN-GYRO1, sheet 1]

### Parts
C3.1  10nF/⇤  C-EUC0805  [C0805]
C3.2  100nF/⇤  C-EUC0402K  [C0402K]
C3.XX  10nF/⇤  C-EUC0805  [C0805]
R3.1  10kR/⎒  R-EU_R0603  [R0603]
R3.2  10kR/⎒  R-EU_R0402  [R0402]
R3.3  10kR/⎑  R-EU_R0402  [R0402]
R3.4  10kR/⎑  R-EU_R0402  [R0402]
R3.5  10kR/⎒  R-EU_R0402  [R0402]
R3.6  10kR/⎒  R-EU_R0402  [R0402]
R3.9  60R/⇤  R-EU_R0603  [R0603]
R3.10  10k/⎒  R-EU_R0402  [R0402]
R3.11  10kR/⎑  R-EU_R0402  [R0402]
U3.1  LSM9DS1  [LGA-24]
☇1  PTR1TP07SQ  [TP07SQ]
☇2  PTR1TP07SQ  [TP07SQ]
☇3  PTR1TP07SQ  [TP07SQ]

### Nets
+3V3: R3.1.1 R3.2.1 R3.5.1 R3.6.1 R3.10.1 U3.1.1(VDDIO) U3.1.3(VDDIO) U3.1.22(VDD) U3.1.23(VDD)
CS_AG: R3.1.2 U3.1.7(CS_A/G)
CS_M: R3.2.2 U3.1.8(CS_M)
DEN_AG: R3.10.2 R3.11.1 U3.1.13(DEN_A/G)
DRDY_M: U3.1.9(DRDY_M) ☇1.TP
GND: C3.1.2 C3.2.2 C3.XX.2 R3.3.2 R3.4.2 R3.9.2 R3.11.2 U3.1.14(RES) U3.1.15(RES) U3.1.16(RES) U3.1.17(RES) U3.1.18(RES) U3.1.19(GND) U3.1.20(GND)
INT1_AG: C3.XX.1 R3.9.1 U3.1.11(INT1_A/G)
INT2_AG: U3.1.12(INT2_A/G) ☇3.TP
INT_M: U3.1.10(INT_M) ☇2.TP
SCL: U3.1.2(SCL/SPC)
SDA: U3.1.4(SDA/SDI/SDO)
SDO_AG: R3.3.1 R3.6.2 U3.1.5(SDO_A/G)
SDO_M: R3.4.1 R3.5.2 U3.1.6(SDO_M)
↔C1: C3.2.1 U3.1.24(C1)
↔CAP: C3.1.1 U3.1.21(CAP)

### Notes on the sheet
- TWI A/G ADR: 0x6A
  TWI M    ADR: 0x1C
- TODO: Rename identifiers to submod UID scheme
- TODO after routing:
  fix identifiers
- [TODO1] Integrate ADNS3080

### Library data of the parts
C3.1 C3.2 C3.XX = rcl:C-EU: CAPACITOR, European symbol
R3.1-R3.6 R3.9-R3.11 = rcl:R-EU_: RESISTOR, European symbol
U3.1 = kitt.ic:LSM9DS1; AVAILABILITY: Unavailable; CC: XYX17; DESCRIPTION: iNEMO inertial module: 3D accelerometer, 3D gyroscope, 3D magnetometer; MF: STMicroelectronics; MP: LSM9DS1; PACKAGE: None; PRICE: None
☇1-☇3 = testpad:PTR1: TEST PIN

## Module POW-DRV01
Ports: COM(io) EN1(io) EN0(io) OD0(io) OD1(io)
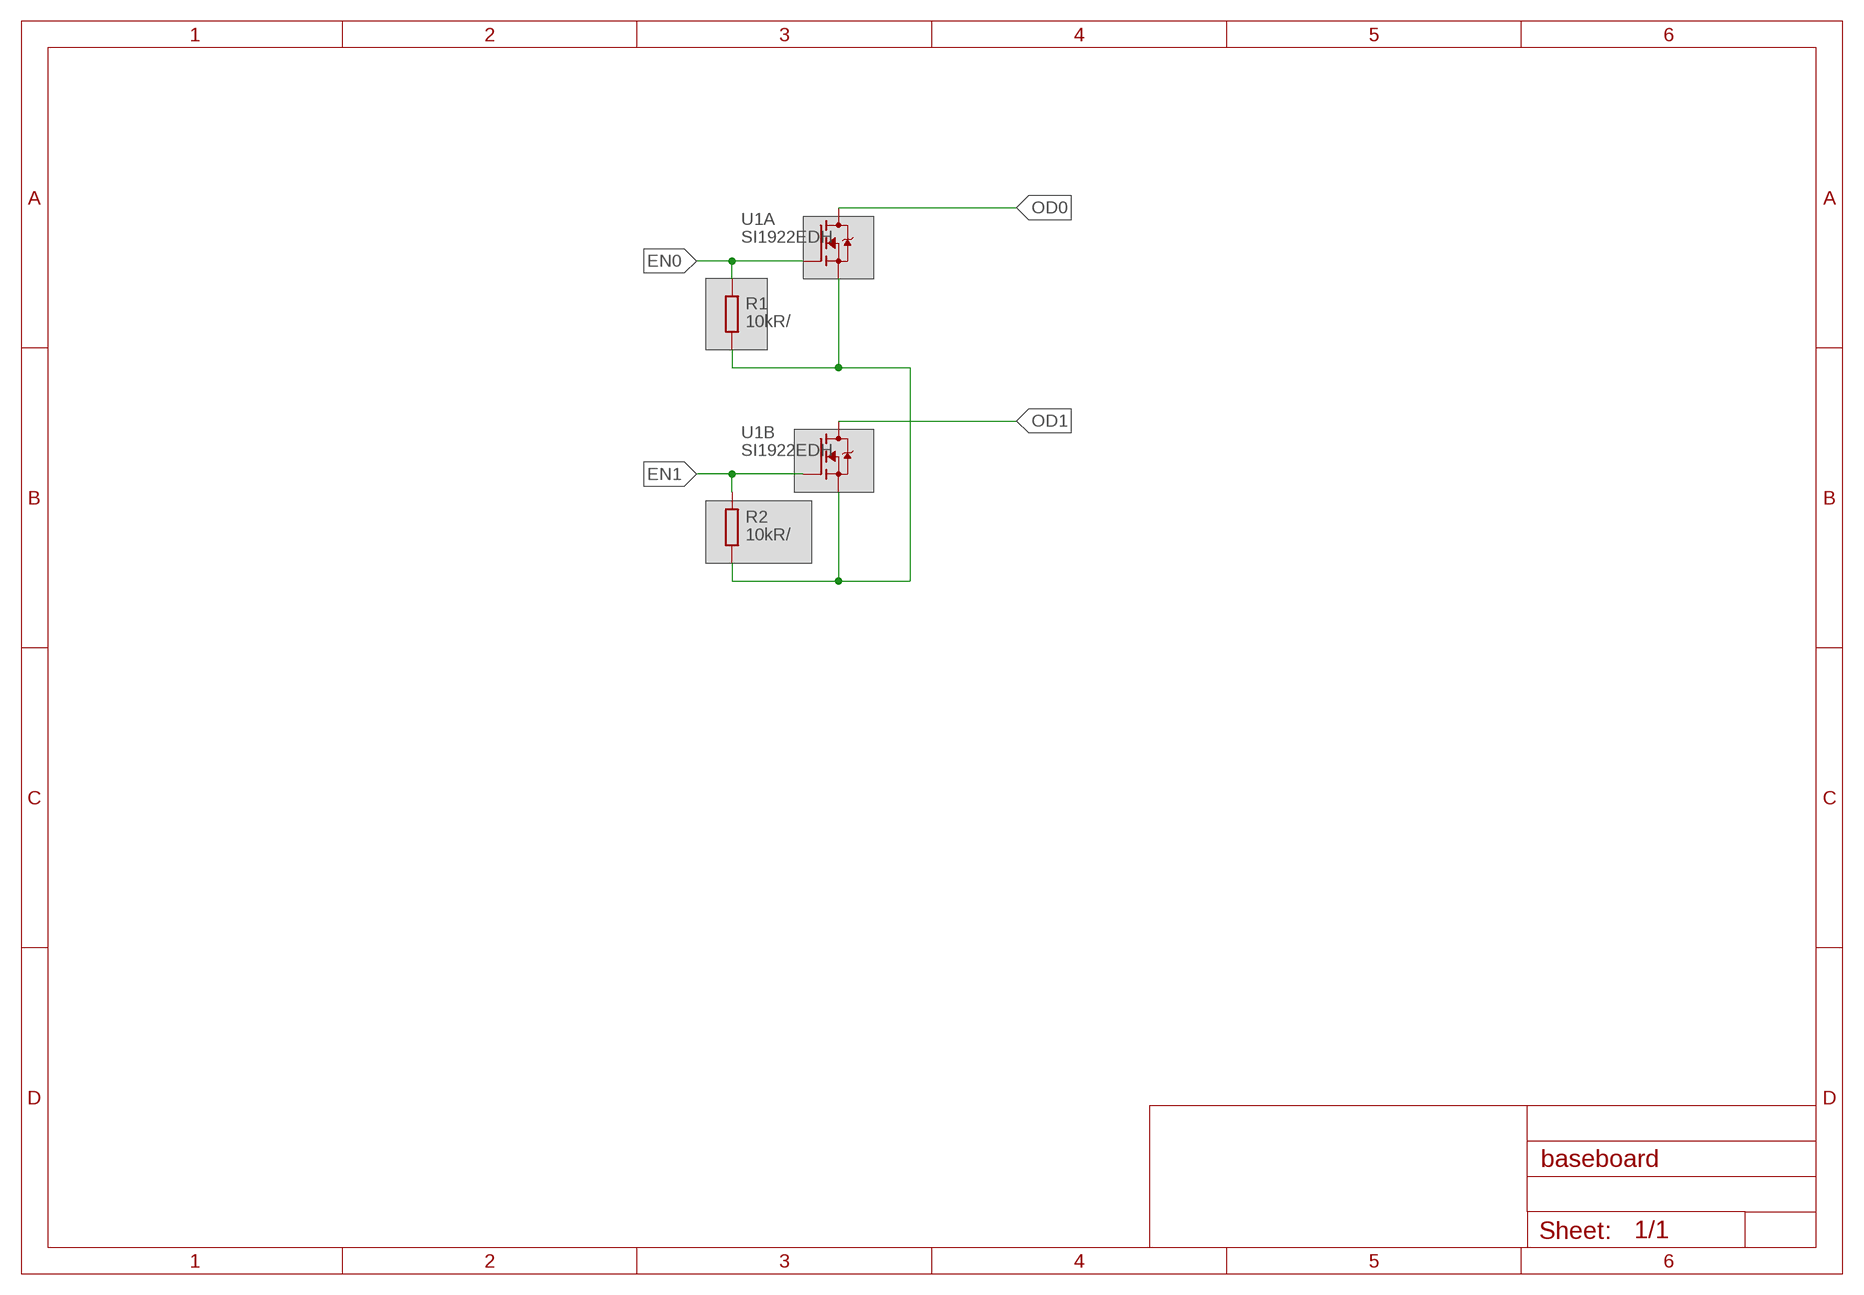
[diagram p6: schematic, module POW-DRV01, sheet 1]

### Parts
R1  10kR/⎑  R-EU_R0402  [R0402]
R2  10kR/⎑  R-EU_R0402  [R0402]
U1  SI1922EDH  [SC70-6]

### Nets
COM: R1.1 R2.1 U1.1(A:S) U1.4(B:S)
EN0: R1.2 U1.2(A:G)
EN1: R2.2 U1.5(B:G)
OD0: U1.6(A:D)
OD1: U1.3(B:D)

### Library data of the parts
R1 R2 = rcl:R-EU_: RESISTOR, European symbol
U1 = kitt.ic:SI1922EDH

## Module X1-TRACKBOARD3080
Ports: !CS0(io) SCLK(io) MOSI(io) MISO(io) !CS1(io) !INT(io) SDA(io) SCL(io) GND(pwr) +3V3(pwr) +5V(pwr) VSYS(pwr) V++(pwr) ADC0(io) ADC1(io) !RESET(io) MRXS(io) MTXS(io)
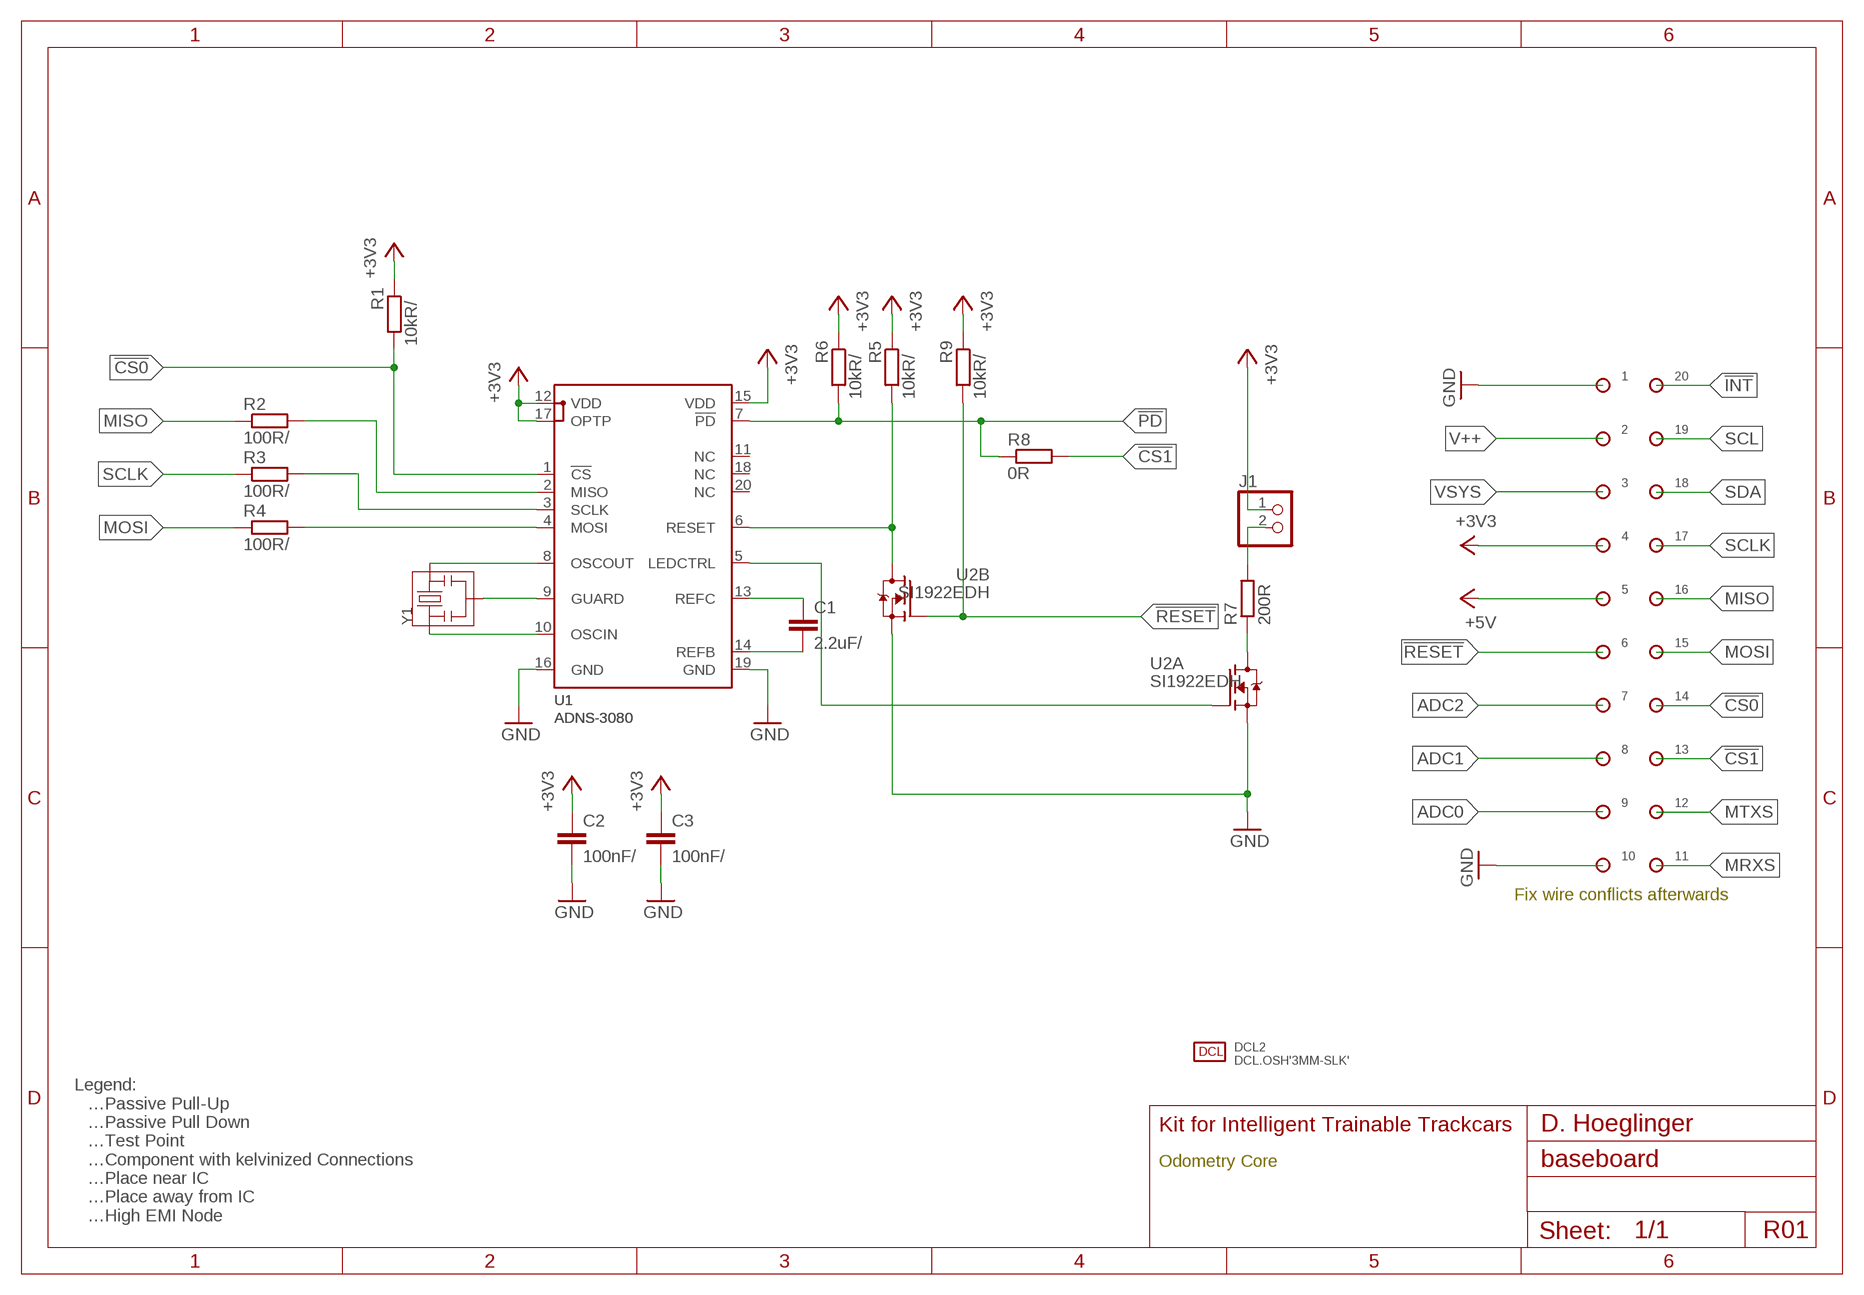
[diagram p7: schematic, module X1-TRACKBOARD3080, sheet 1]

### Parts
C1  2.2uF/⇤  C-EUC1608  [C1608]
C2  100nF/⇤  C-EUC0805K  [C0805K]
C3  100nF/⇤  C-EUC0805K  [C0805K]
DCL2  DCL.OSH'3MM-SLK'  [DCL.LOGO-OSH.3MM]
J1  PINHD-1X2  [1X02]
R1  10kR/⎒  R-EU_R0402  [R0402]
R2  100R/⇤  R-EU_R0402  [R0402]
R3  100R/⇤  R-EU_R0402  [R0402]
R4  100R/⇤  R-EU_R0402  [R0402]
R5  10kR/⎒  R-EU_R0402  [R0402]
R6  10kR/⎒  R-EU_R0402  [R0402]
R7  200R  R-EU_R0402  [R0402]
R8  0R  R-EU_R0402  [R0402]
R9  10kR/⎒  R-EU_R0402  [R0402]
U1  ADNS-3080  [ADNS-3080]
U2  SI1922EDH  [SC70-6]
Y1  24MHz  RESON  [RESON-SMD]
⌁1  SINGLEPAD40MIL-BREAK  [PAD40MIL.BREAK]
⌁2  SINGLEPAD40MIL-BREAK  [PAD40MIL.BREAK]
⌁3  SINGLEPAD40MIL-BREAK  [PAD40MIL.BREAK]
⌁4  SINGLEPAD40MIL-BREAK  [PAD40MIL.BREAK]
⌁5  SINGLEPAD40MIL-BREAK  [PAD40MIL.BREAK]
⌁6  SINGLEPAD40MIL-BREAK  [PAD40MIL.BREAK]
⌁7  SINGLEPAD40MIL-BREAK  [PAD40MIL.BREAK]
⌁8  SINGLEPAD40MIL-BREAK  [PAD40MIL.BREAK]
⌁9  SINGLEPAD40MIL-BREAK  [PAD40MIL.BREAK]
⌁10  SINGLEPAD40MIL-BREAK  [PAD40MIL.BREAK]
⌁11  SINGLEPAD40MIL-BREAK  [PAD40MIL.BREAK]
⌁12  SINGLEPAD40MIL-BREAK  [PAD40MIL.BREAK]
⌁13  SINGLEPAD40MIL-BREAK  [PAD40MIL.BREAK]
⌁14  SINGLEPAD40MIL-BREAK  [PAD40MIL.BREAK]
⌁15  SINGLEPAD40MIL-BREAK  [PAD40MIL.BREAK]
⌁16  SINGLEPAD40MIL-BREAK  [PAD40MIL.BREAK]
⌁17  SINGLEPAD40MIL-BREAK  [PAD40MIL.BREAK]
⌁18  SINGLEPAD40MIL-BREAK  [PAD40MIL.BREAK]
⌁19  SINGLEPAD40MIL-BREAK  [PAD40MIL.BREAK]
⌁20  SINGLEPAD40MIL-BREAK  [PAD40MIL.BREAK]

### Nets
!CS0: R1.2 U1.1(!CS) ⌁14.P$1
!CS1: R8.2 ⌁13.P$1
!INT: ⌁20.P$1
!PD: R6.2 R8.1 U1.7(!PD)
!RESET: R9.2 U2.5(B:G) ⌁6.P$1
+3V3: C2.1 C3.1 J1.1 R1.1 R5.1 R6.1 R9.1 U1.12(VDD) U1.15(VDD) U1.17(OPTP) ⌁4.P$1
+5V: ⌁5.P$1
ADC0: ⌁9.P$1
ADC1: ⌁8.P$1
ADC2: ⌁7.P$1
GND: C2.2 C3.2 U1.16(GND) U1.19(GND) U2.1(A:S) U2.4(B:S) ⌁1.P$1 ⌁10.P$1
LEDCTRL: U1.5(LEDCTRL) U2.2(A:G)
MISO: R2.1 ⌁16.P$1
MOSI: R4.1 ⌁15.P$1
MRXS: ⌁11.P$1
MTXS: ⌁12.P$1
N$1: R7.1 U2.6(A:D)
N$5: C1.1 U1.13(REFC)
N$6: C1.2 U1.14(REFB)
N$8: J1.2 R7.2
RST: R5.2 U1.6(RESET) U2.3(B:D)
SCL: ⌁19.P$1
SCLK: R3.1 ⌁17.P$1
SDA: ⌁18.P$1
U1.GUARD: U1.9(GUARD) Y1.2
U1.MISO: R2.2 U1.2(MISO)
U1.MOSI: R4.2 U1.4(MOSI)
U1.OSCIN✳: U1.10(OSCIN) Y1.1
U1.OSCOUT✳: U1.8(OSCOUT) Y1.3
U1.SCLK: R3.2 U1.3(SCLK)
V++: ⌁2.P$1
VSYS: ⌁3.P$1
Unconnected: U1.11(NC) U1.18(NC) U1.20(NC)

### Notes on the sheet
- Fix wire conflicts afterwards
- Legend:
  ⎒…Passive Pull-Up
  ⎑…Passive Pull Down
  ☇…Test Point
  ⚻…Component with kelvinized Connections
  ⇤…Place near IC
  ↦…Place away from IC
  ✳…High EMI Node
- Kit for Intelligent Trainable Trackcars | D. Hoeglinger
- Odometry Core
- R01

### Library data of the parts
C1-C3 = rcl:C-EU: CAPACITOR, European symbol
DCL2 = kitt.refs:DCL.OSH
J1 = pinhead:PINHD-1X2: PIN HEADER
R1-R9 = rcl:R-EU_: RESISTOR, European symbol
U1 = kitt.ic:ADNS-3080
U2 = kitt.ic:SI1922EDH
Y1 = Ai_Passives:RESON
⌁1-⌁20 = kitt.con:SINGLEPAD

## Module POW-DDC3350
Ports: VIN(pwr) VOUT(pwr) INACT(out) EN(in) PGND(pwr) AGND(pwr)
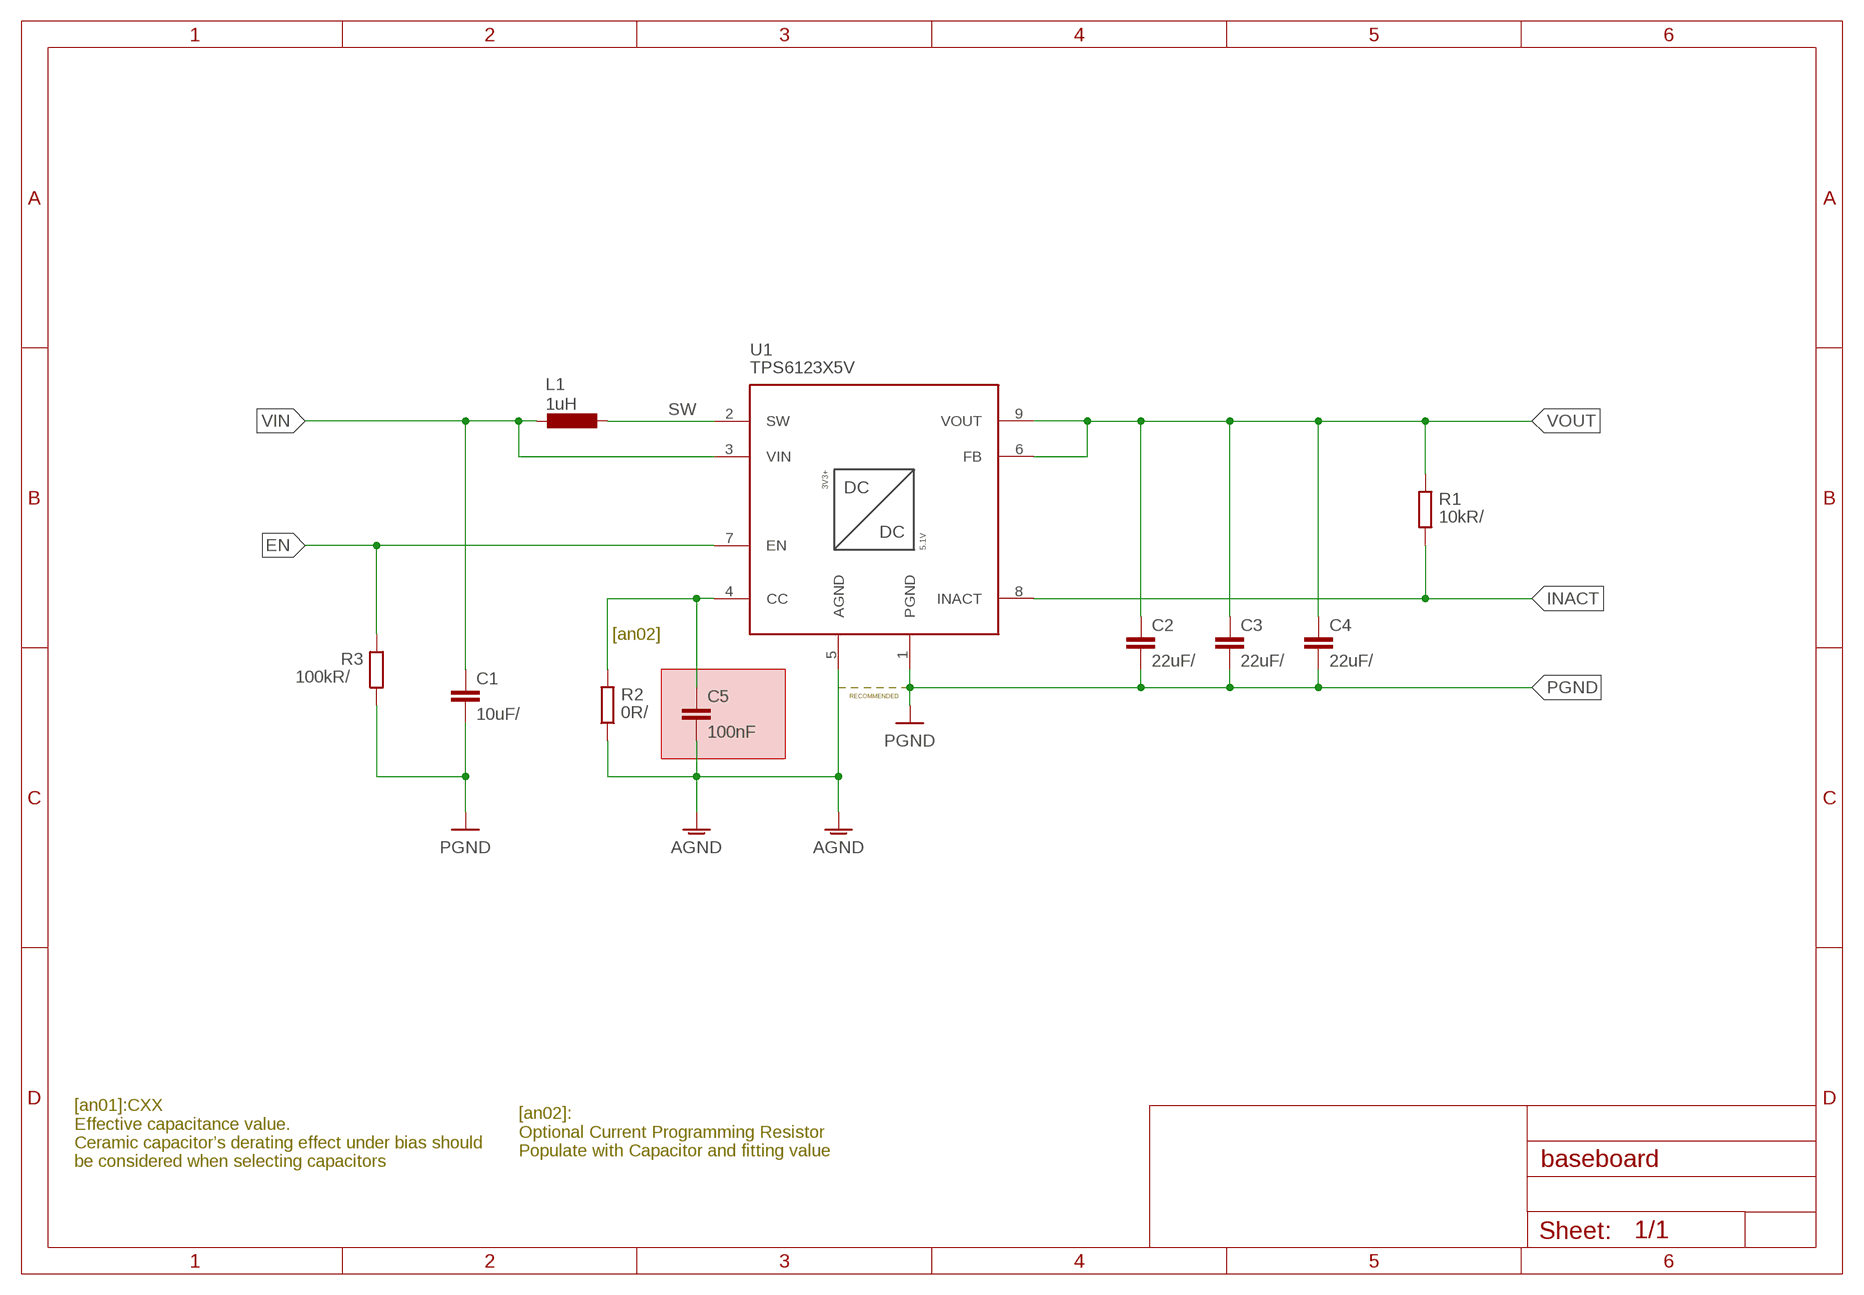
[diagram p8: schematic, module POW-DDC3350, sheet 1]

### Parts
C1  10uF/⇤  C-EUC0805K  [C0805K]
C2  22uF/⇤  C-EUC0805K  [C0805K]
C3  22uF/⇤  C-EUC0805K  [C0805K]
C4  22uF/⇤  C-EUC0805K  [C0805K]
C5  100nF  C-EUC0805K  [C0805K]
L1  1uH  NRS8030XX  [TAIYO-YUDEN.NRS8030T4R7MJGJ]
R1  10kR/⎒  R-EU_R0805W  [R0805W]
R2  0R/⎵  R-EU_R0402  [R0402]
R3  100kR/⎵  R-EU_R0402  [R0402]
U1  TPS6123X5V  [9-VQFN-HR]

### Nets
AGND: C5.2 R2.1 U1.5(AGND)
CC: C5.1 R2.2 U1.4(CC)
EN: R3.2 U1.7(EN)
INACT: R1.1 U1.8(INACT)
PGND: C1.2 C2.2 C3.2 C4.2 R3.1 U1.1(PGND)
VIN: C1.1 L1.1 U1.3(VIN)
VOUT: C2.1 C3.1 C4.1 R1.2 U1.6(FB) U1.9(VOUT)
✳SW: L1.2 U1.2(SW)

### Notes on the sheet
- [an02]
- RECOMMENDED
- [an02]: 
  Optional Current Programming Resistor
  Populate with Capacitor and fitting value
- [an01]:CXX
  Effective capacitance value.
  Ceramic capacitor’s derating effect under bias should
  be considered when selecting capacitors

### Library data of the parts
C1-C5 = rcl:C-EU: CAPACITOR, European symbol
L1 = kitt.psvs:NRS8030XX
R1 = rcl:R-EU_: RESISTOR, European symbol
R2 R3 = resistor:R-EU_: RESISTOR, European symbol
U1 = kitt.ic:TPS6123X; CC: XYX17

## Module POW-CTRLMON
Ports: S2.INACT(in) S1.RUN(out) S1.PGOOD(in) S1.MODE(out) S1.FREQ(out) VDD(pwr) !RST(in) !INT(io) SCL(io) SDA(io) TOP[0..7](io) GND(pwr) S1.ENC(io) S1.!CHRG(in) S1.!FLT(in)
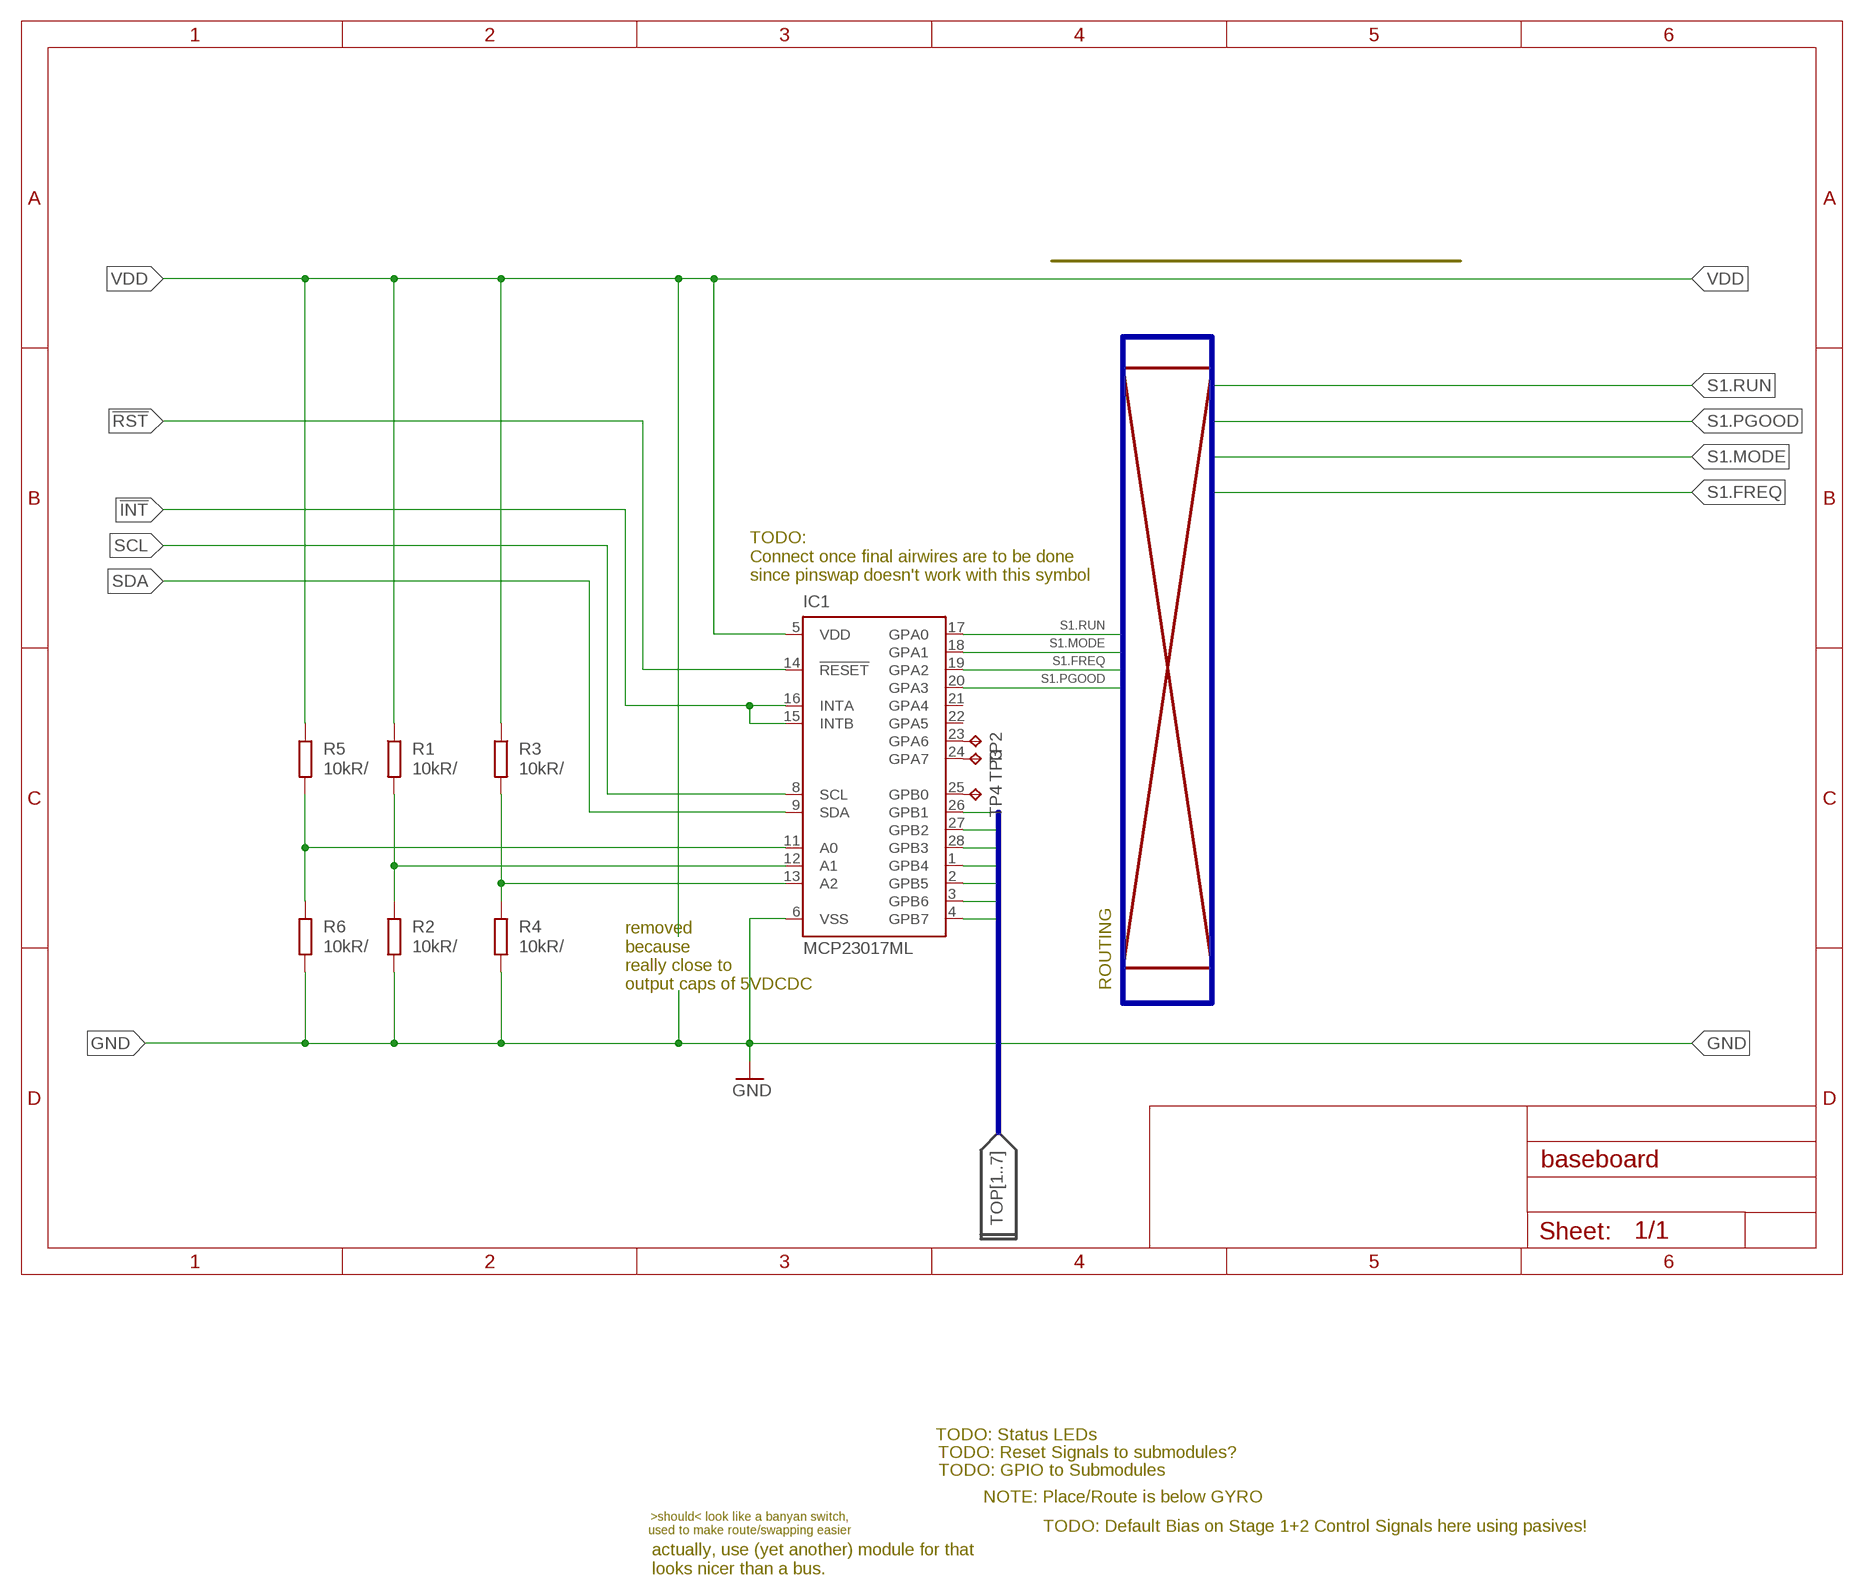
[diagram p9: schematic, module POW-CTRLMON, sheet 1]

### Parts
IC1  MCP23017ML  [QFN28-ML_6X6MM]
R1  10kR/⎒  R-EU_R0402  [R0402]
R2  10kR/⎑  R-EU_R0201  [R0201]
R3  10kR/⎒  R-EU_R0402  [R0402]
R4  10kR/⎒  R-EU_R0201  [R0201]
R5  10kR/⎒  R-EU_R0402  [R0402]
R6  10kR/⎒  R-EU_R0201  [R0201]
TP2  TPTP07R  [TP07R]
TP3  TPTP07R  [TP07R]
TP4  TPTP07R  [TP07R]

### Nets
!INT: IC1.15(INTB) IC1.16(INTA)
!RST: IC1.14(!RESET)
A0: IC1.11(A0) R5.2 R6.1
A1: IC1.12(A1) R1.2 R2.1
A2: IC1.13(A2) R3.2 R4.1
GND: IC1.6(VSS) R2.2 R4.2 R6.2
N$3: IC1.23(GPA6) TP2.TP
N$4: IC1.24(GPA7) TP3.TP
N$5: IC1.25(GPB0) TP4.TP
S1.FREQ: IC1.19(GPA2)
S1.MODE: IC1.18(GPA1)
S1.PGOOD: IC1.20(GPA3)
S1.RUN: IC1.17(GPA0)
SCL: IC1.8(SCL)
SDA: IC1.9(SDA)
TOP1: IC1.26(GPB1)
TOP2: IC1.27(GPB2)
TOP3: IC1.28(GPB3)
TOP4: IC1.1(GPB4)
TOP5: IC1.2(GPB5)
TOP6: IC1.3(GPB6)
TOP7: IC1.4(GPB7)
VDD: IC1.5(VDD) R1.1 R3.1 R5.1
Unconnected: IC1.21(GPA4) IC1.22(GPA5)

### Buses
S1.RUN,S1.PGOOD,S1.MODE,S1.FREQ,S2.INACT,S2.EN
TOP[1..7]
S1.RUN,S1.PGOOD,S1.MODE,S1.FREQ,S2.INACT,S2.EN,S1.ENC,S1.!CHRG,S1.!FLT

### Notes on the sheet
- TODO:
  Connect once final airwires are to be done
  since pinswap doesn't work with this symbol
- ⨯
- ⨯
- removed
  because
  really close to
  output caps of 5VDCDC
- ROUTING
- TODO: Status LEDs
- TODO: Reset Signals to submodules?
- TODO: GPIO to Submodules
- NOTE: Place/Route is below GYRO
- >should< look like a banyan switch,
  used to make route/swapping easier
- TODO: Default Bias on Stage 1+2 Control Signals here using pasives!
- actually, use (yet another) module for that
  looks nicer than a bus.

### Library data of the parts
IC1 = microchip:MCP23017: http://ww1.microchip.com/downloads/en/DeviceDoc/21952a.pdf Source: http://ww1.microchip.com/downloads/en/DeviceDoc/21952a.pdf; MF: MICROCHIP; MPN: MCP23017-E/ML; OC_FARNELL: unknown; OC_NEWARK: 31K2957
R1-R6 = rcl:R-EU_: RESISTOR, European symbol
TP2-TP4 = testpad:TP: Test pad

## Module POW-IPMC
Ports: GND(pwr) V~IN(pwr) VF+OUT(pwr) V+PWR(pwr) COM.RRX(io) MON.VPWR(io)
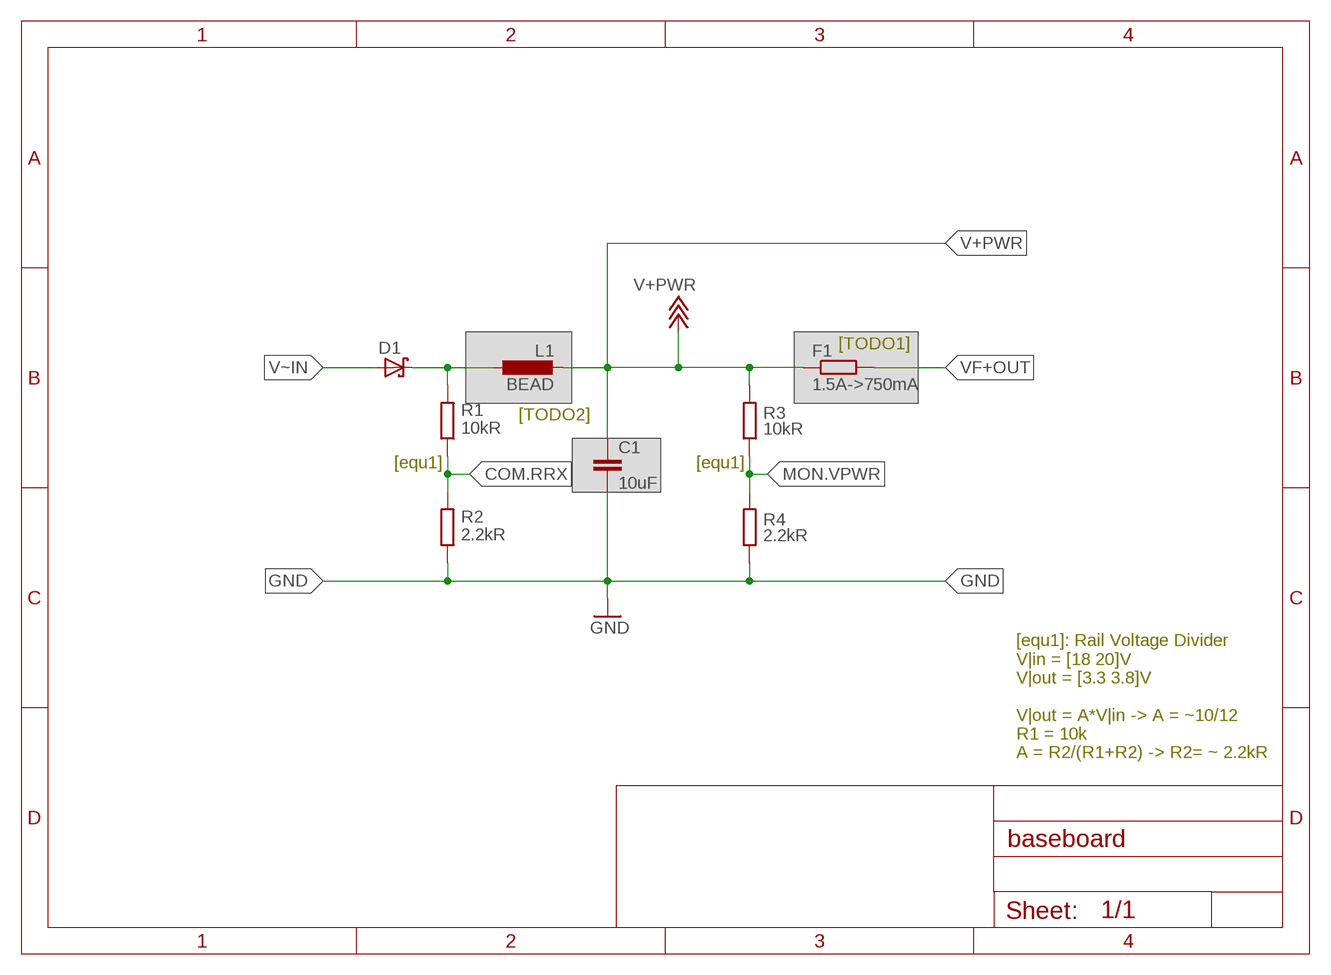
[diagram p10: schematic, module POW-IPMC, sheet 1]

### Parts
C1  10uF  C-EUC1210K  [C1210K]
D1  SCHOTTKY-DIODESMD  [SMB]
F1  1.5A->750mA  R-EU_R1210  [R1210]
L1  BEAD  L-EUL2012C  [L2012C]
R1  10kR  R-EU_R0805W  [R0805W]
R2  2.2kR  R-EU_R0805W  [R0805W]
R3  10kR  R-EU_R0805W  [R0805W]
R4  2.2kR  R-EU_R0805W  [R0805W]

### Nets
COM.RRX: R1.1 R2.2
GND: C1.2 R2.1 R4.1
MON.VPWR: R3.1 R4.2
N$1: D1.C L1.1 R1.2
V+PWR: C1.1 F1.1 L1.2 R3.2
VF+OUT: F1.2
V~IN: D1.A

### Notes on the sheet
- [TODO1]
- [TODO2]
- [equ1] | [equ1]
- [equ1]: Rail Voltage Divider
  V|in = [18 20]V
  V|out = [3.3 3.8]V
  
  V|out = A*V|in -> A = ~10/12
  R1 = 10k
  A = R2/(R1+R2) -> R2= ~ 2.2kR

### Library data of the parts
C1 = rcl:C-EU: CAPACITOR, European symbol
D1 = diode:SCHOTTKY-DIODE: Schottky Diode
F1 R1-R4 = rcl:R-EU_: RESISTOR, European symbol
L1 = rcl:L-EU: INDUCTOR, European symbol

## Module POW-1540
Ports: POW.SINK(pwr) GND(pwr) POW.SRC(pwr) VBAT(pwr) CTRL.!ACT(out) CTRL.PWRON(in) CTRL.!BATOK(io)

### Sheet 1 of 2
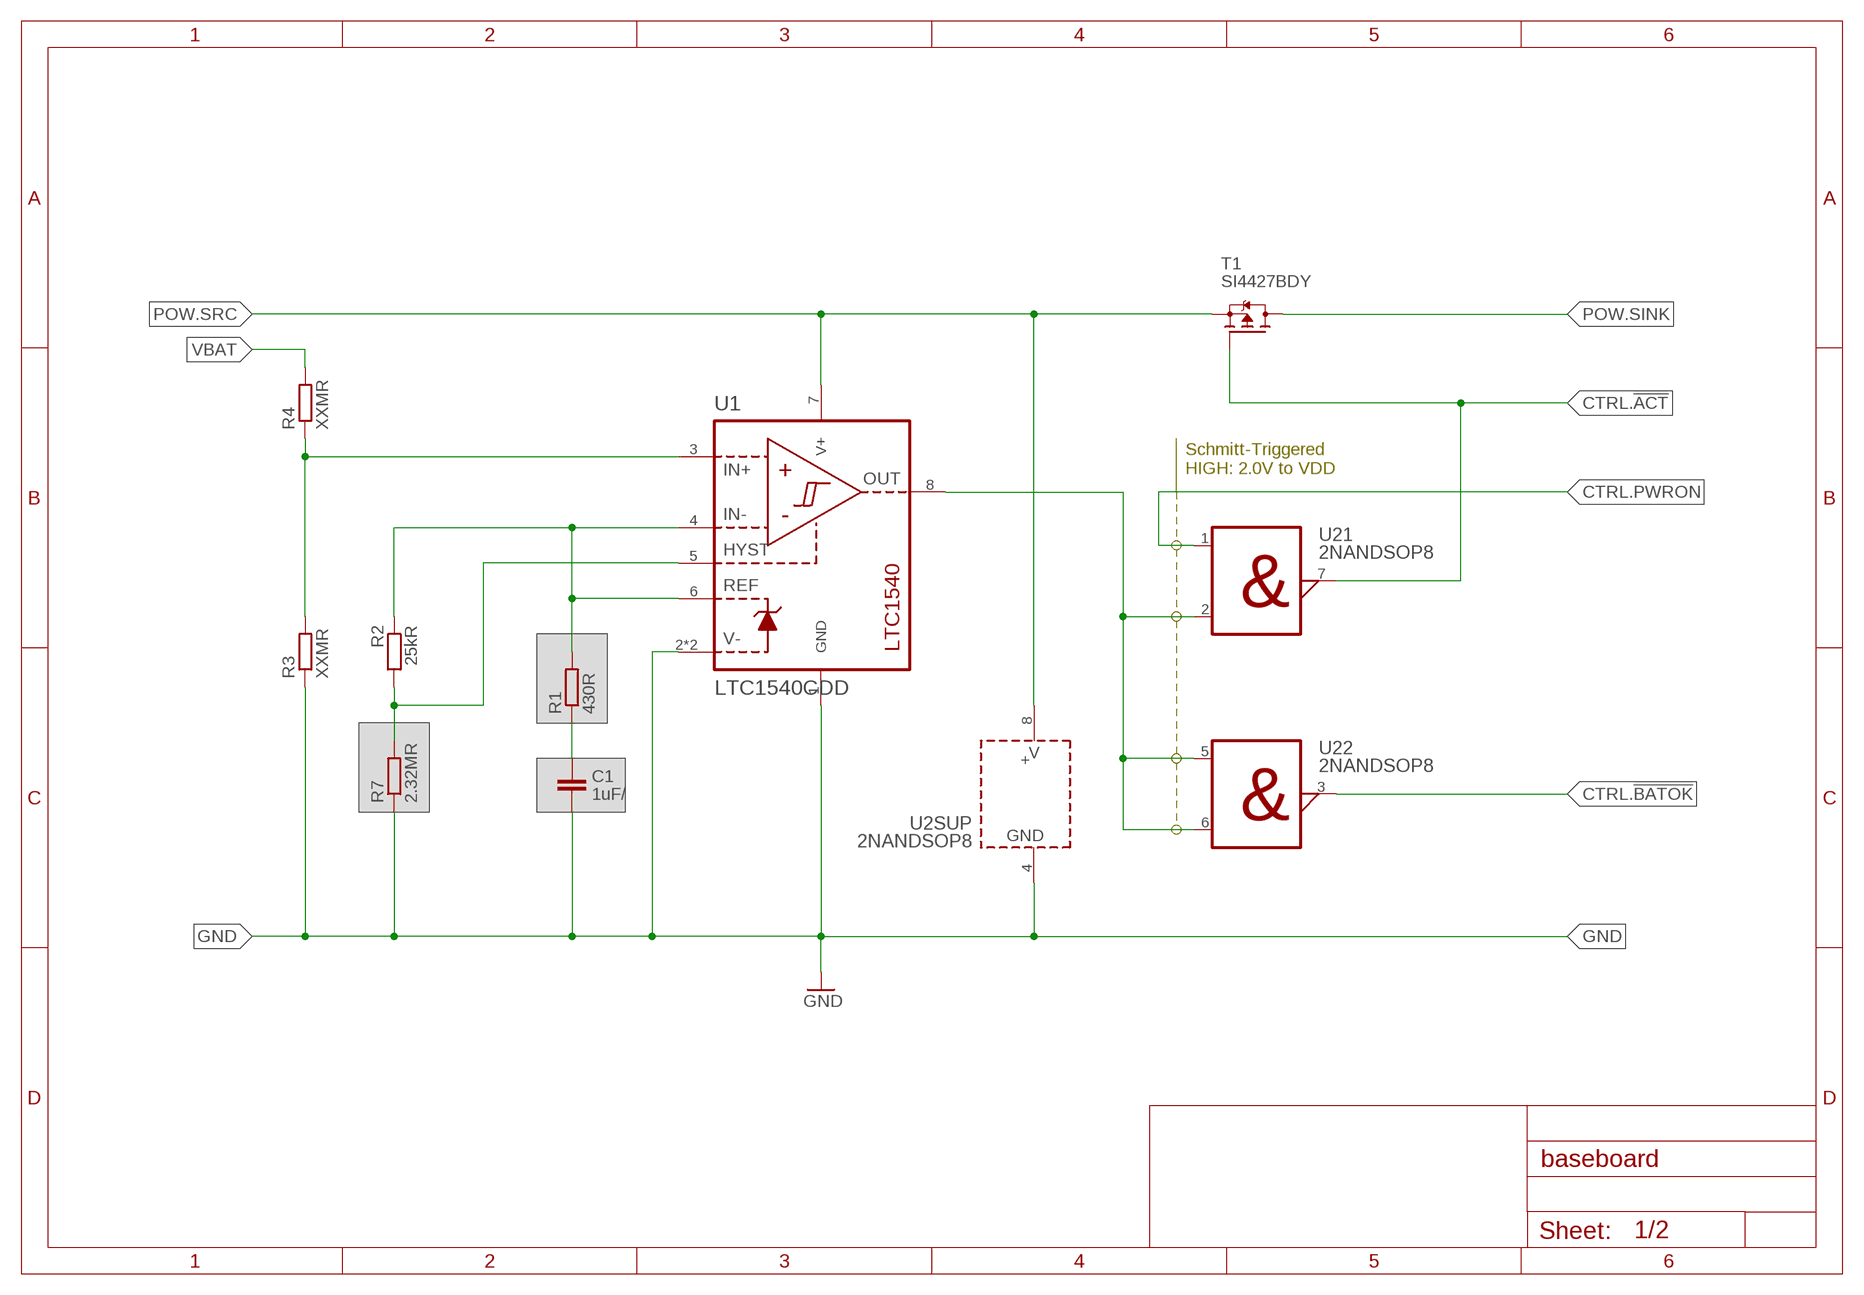
[diagram p11: schematic, module POW-1540, sheet 1]

#### Parts
C1  1uF/⇤  C-EUC0402K  [C0402K]
R1  430R  R-EU_R0402  [R0402]
R2  25kR  R-EU_R0402  [R0402]
R3  XXMR  R-EU_M0805  [M0805]
R4  XXMR  R-EU_M0805  [M0805]
R7  2.32MR  R-EU_R0402  [R0402]
T1  SI4427BDY  [SOIC8]
U1  LTC1540CDD  [DFN-8_DD]
U2  2NANDSOP8  [SOP65P490X110-8N]

#### Nets
BATOK: U1.8(OUT) U2.2(1:B) U2.5(2:A) U2.6(2:B)
COMP: C1.1 R1.1
CTRL.!ACT: T1.4(G) U2.7(1:Y)
CTRL.!BATOK: U2.3(2:Y)
CTRL.PWRON: U2.1(1:A)
GND: C1.2 R3.1 R7.1 U1.1(GND) U1.2(V-) U1.EP(V-) U2.4(SUP:GND)
HYST: R2.2 R7.2 U1.5(HYST)
IN-: R3.2 R4.1 U1.3(IN+)
POW.SINK: T1.5(D) T1.6(D) T1.7(D) T1.8(D)
POW.SRC: T1.1(S) T1.2(S) T1.3(S) U1.7(V+) U2.8(SUP:V+)
REF: R1.2 R2.1 U1.4(IN-) U1.6(REF)
VBAT: R4.2

#### Notes on the sheet
- Schmitt-Triggered
  HIGH: 2.0V to VDD

### Sheet 2 of 2
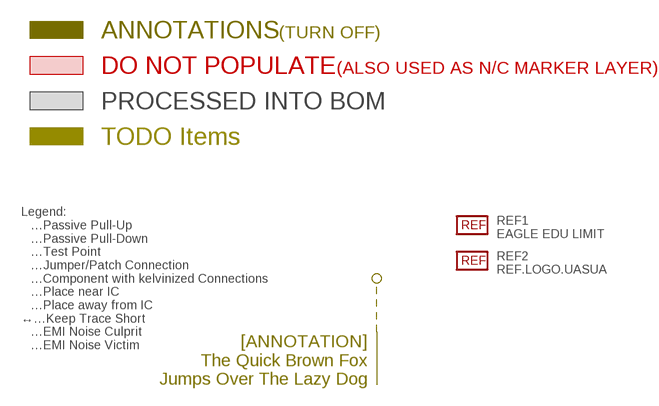
[diagram p12: schematic, module POW-1540, sheet 2]

#### Parts
REF1  EAGLE EDU LIMIT  REF.EDULIMIT  [REF_EAGLE.EDULIMIT]
REF2  REF.LOGO.UASUA  [REF_LOGO_UASUA]

#### Notes on the sheet
- ANNOTATIONS | (TURN OFF)
- DO NOT POPULATE | (ALSO USED AS N/C MARKER LAYER)
- PROCESSED INTO BOM
- TODO Items
- Legend:
  ⎒…Passive Pull-Up
  ⎑…Passive Pull-Down
  ☇…Test Point
  ☈…Jumper/Patch Connection
  ⚻…Component with kelvinized Connections
  ⇤…Place near IC
  ↦…Place away from IC
  ↔…Keep Trace Short
  ✳…EMI Noise Culprit
  ✧…EMI Noise Victim
- [ANNOTATION]
  The Quick Brown Fox
  Jumps Over The Lazy Dog

### Library data of the parts
C1 = rcl:C-EU: CAPACITOR, European symbol
R1-R4 R7 = rcl:R-EU_: RESISTOR, European symbol
REF1 = kitt.refs:REF.EDULIMIT
REF2 = kitt.refs:REF.LOGO.UASUA
T1 = kitt.ic:SI4427BDY
U1 = kitt.ic:LTC1540; CC: XYX17
U2 = kitt.ic:2NAND